# Altium project WZ_mBoard.PrjPcb (part 1 of 2)
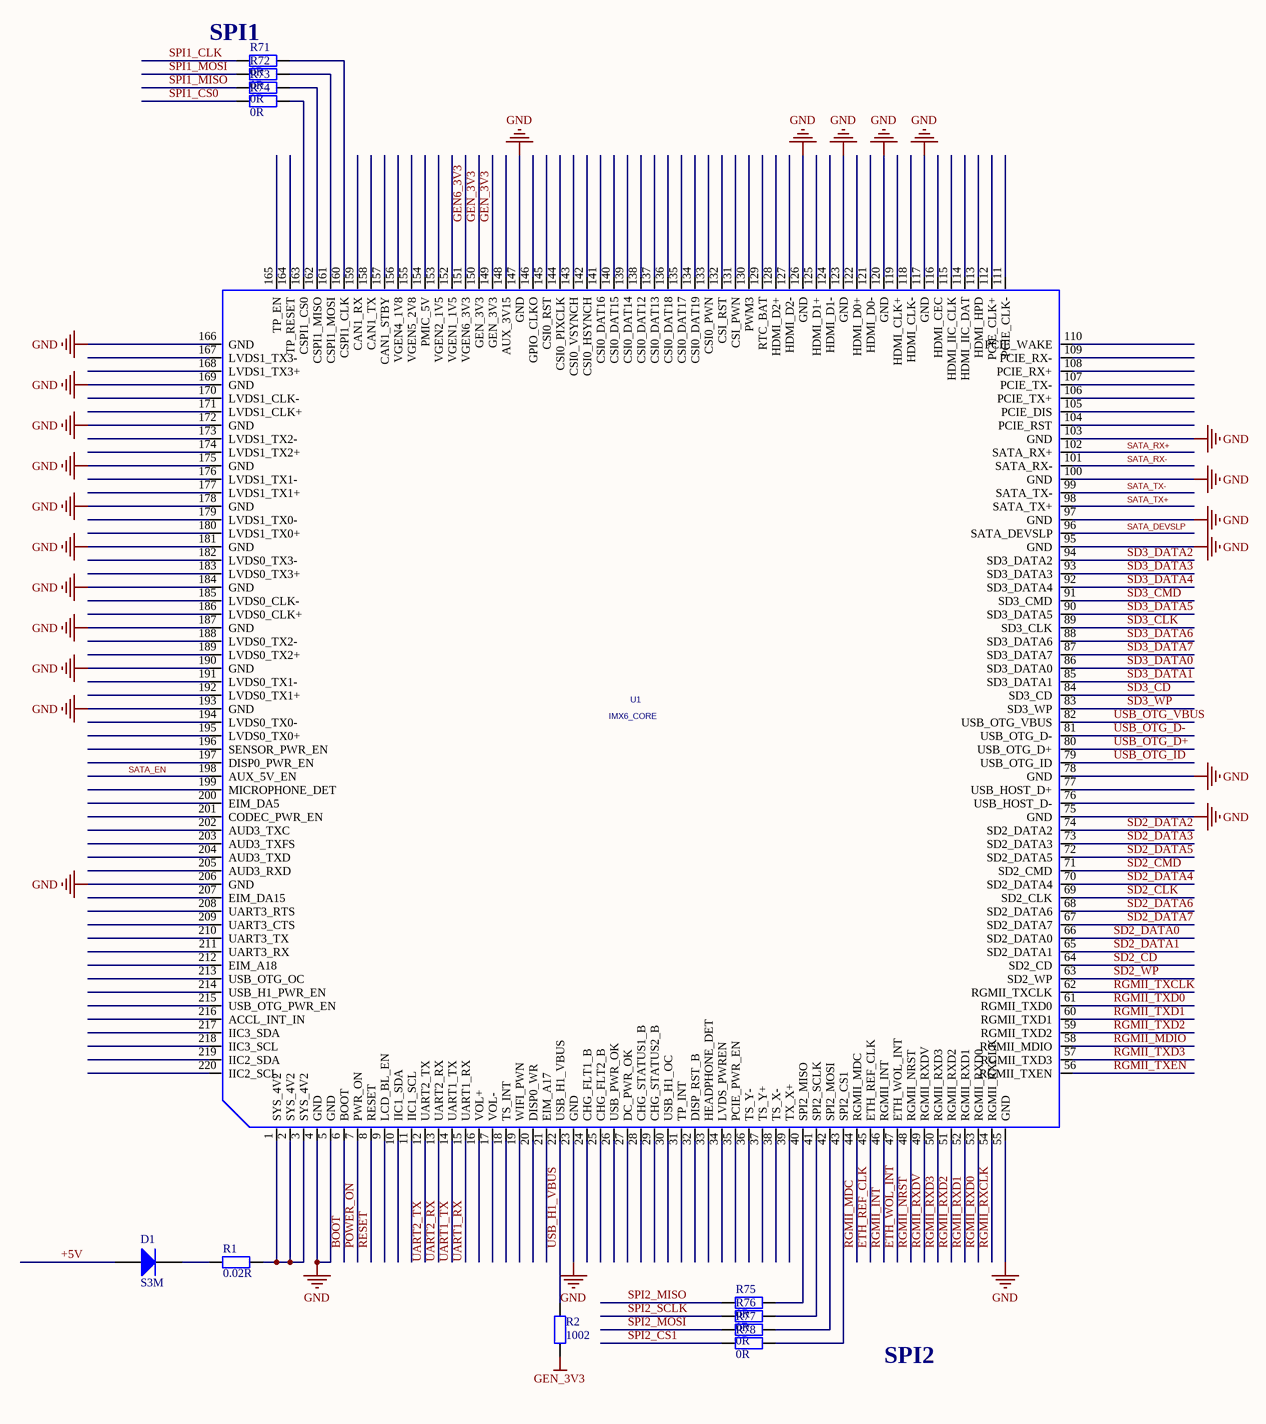
[diagram p0: IMx6Q.SchDoc]
7 sheets, 348 parts. Net scope: global (net labels, ports and power ports of the same name join across sheets).
Sheets:
  IMx6Q.SchDoc
  IMx6Q_EX.SchDoc
  EP4CE75.SchDoc
  FPGA_PWR.SchDoc
  NET.SchDoc
  485Driver_MAX3462.SchDoc
  STM32F103RBT6.SchDoc

## Sheet IMx6Q.SchDoc
size A3

### Parts
D1  S3M  [DSO-C2/X3.3]
R1  0.02R  [R1210]
R2  1002  [0603]
R71  0R  [0603]
R72  0R  [0603]
R73  0R  [0603]
R74  0R  [0603]
R75  0R  [0603]
R76  0R  [0603]
R77  0R  [0603]
R78  0R  [0603]
U1  IMX6_CORE  [IMX6_CORE]

### Nets
GEN6_3V3: U1.151(VGEN6_3V3)
GEN_3V3: R2.2 U1.149(GEN_3V3) U1.150(GEN_3V3)
GND: U1.4(GND) U1.5(GND) U1.23(GND) U1.55(GND) U1.75(GND) U1.78(GND) U1.95(GND) U1.97(GND) U1.100(GND) U1.103(GND) U1.117(GND) U1.120(GND) U1.123(GND) U1.126(GND) U1.147(GND) U1.166(GND) U1.169(GND) U1.172(GND) U1.175(GND) U1.178(GND) U1.181(GND) U1.184(GND) U1.187(GND) U1.190(GND) U1.193(GND) U1.206(GND)  [project net DGND]
USB_OTG_VBUS: U1.82(USB_OTG_VBUS)
+5V: D1.1(A)
BOOT: U1.6(BOOT)
ETH_REF_CLK: U1.45(ETH_REF_CLK)
ETH_WOL_INT: U1.47(ETH_WOL_INT)
POWER_ON: U1.7(PWR_ON)
RESET: U1.8(RESET)
RGMII_INT: U1.46(RGMII_INT)
RGMII_MDC: U1.44(RGMII_MDC)
RGMII_MDIO: U1.58(RGMII_MDIO)
RGMII_NRST: U1.48(RGMII_NRST)
RGMII_RXCLK: U1.54(RGMII_RXCLK)
RGMII_RXD0: U1.53(RGMII_RXD0)
RGMII_RXD1: U1.52(RGMII_RXD1)
RGMII_RXD2: U1.51(RGMII_RXD2)
RGMII_RXD3: U1.50(RGMII_RXD3)
RGMII_RXDV: U1.49(RGMII_RXDV)
RGMII_TXCLK: U1.62(RGMII_TXCLK)
RGMII_TXD0: U1.61(RGMII_TXD0)
RGMII_TXD1: U1.60(RGMII_TXD1)
RGMII_TXD2: U1.59(RGMII_TXD2)
RGMII_TXD3: U1.57(RGMII_TXD3)
RGMII_TXEN: U1.56(RGMII_TXEN)
SATA_DEVSLP: U1.96(SATA_DEVSLP)
SATA_EN: U1.198(AUX_5V_EN)
SATA_RX+: U1.102(SATA_RX+)
SATA_RX-: U1.101(SATA_RX-)
SATA_TX+: U1.98(SATA_TX+)
SATA_TX-: U1.99(SATA_TX-)
SD2_CD: U1.64(SD2_CD)
SD2_CLK: U1.69(SD2_CLK)
SD2_CMD: U1.71(SD2_CMD)
SD2_DATA0: U1.66(SD2_DATA0)
SD2_DATA1: U1.65(SD2_DATA1)
SD2_DATA2: U1.74(SD2_DATA2)
SD2_DATA3: U1.73(SD2_DATA3)
SD2_DATA4: U1.70(SD2_DATA4)
SD2_DATA5: U1.72(SD2_DATA5)
SD2_DATA6: U1.68(SD2_DATA6)
SD2_DATA7: U1.67(SD2_DATA7)
SD2_WP: U1.63(SD2_WP)
SD3_CD: U1.84(SD3_CD)
SD3_CLK: U1.89(SD3_CLK)
SD3_CMD: U1.91(SD3_CMD)
SD3_DATA0: U1.86(SD3_DATA0)
SD3_DATA1: U1.85(SD3_DATA1)
SD3_DATA2: U1.94(SD3_DATA2)
SD3_DATA3: U1.93(SD3_DATA3)
SD3_DATA4: U1.92(SD3_DATA4)
SD3_DATA5: U1.90(SD3_DATA5)
SD3_DATA6: U1.88(SD3_DATA6)
SD3_DATA7: U1.87(SD3_DATA7)
SD3_WP: U1.83(SD3_WP)
SPI1_CLK: R71.2
SPI1_CS0: R74.2
SPI1_MISO: R73.2
SPI1_MOSI: R72.2
SPI2_CS1: R78.2
SPI2_MISO: R75.2
SPI2_MOSI: R77.2
SPI2_SCLK: R76.2
UART1_RX: U1.15(UART1_RX)
UART1_TX: U1.14(UART1_TX)
UART2_RX: U1.13(UART2_RX)
UART2_TX: U1.12(UART2_TX)
USB_H1_VBUS: R2.1 U1.22(USB_H1_VBUS)
USB_OTG_D+: U1.80(USB_OTG_D+)
USB_OTG_D-: U1.81(USB_OTG_D-)
USB_OTG_ID: U1.79(USB_OTG_ID)
NetD1_2: D1.2(K) R1.1
NetR1_2: R1.2 U1.1(SYS_4V2) U1.2(SYS_4V2) U1.3(SYS_4V2)
NetR71_1: R71.1 U1.160(CSPI1_CLK)
NetR72_1: R72.1 U1.161(CSPI1_MOSI)
NetR73_1: R73.1 U1.162(CSPI1_MISO)
NetR74_1: R74.1 U1.163(CSPI1_CS0)
NetR75_1: R75.1 U1.40(SPI2_MISO)
NetR76_1: R76.1 U1.41(SPI2_SCLK)
NetR77_1: R77.1 U1.42(SPI2_MOSI)
NetR78_1: R78.1 U1.43(SPI2_CS1)

Not connected (* = marked no-connect by the designer): U1 9(LCD_BL_EN) 10(IIC1_SDA) 11(IIC1_SCL) 16(VOL+) 17(VOL-) 18(TS_INT) 19(WIFI_PWN) 20(DISP0_WR) 21(EIM_A17) 24(CHG_FLT1_B) 25(CHG_FLT2_B) 26(USB_PWR_OK) 27(DC_PWR_OK) 28(CHG_STATUS1_B) 29(CHG_STATUS2_B) 30(USB_H1_OC) 31(TP_INT) 32(DISP_RST_B) 33(HEADPHONE_DET) 34(LVDS_PWREN) 35(PCIE_PWR_EN) 36(TS_Y-) 37(TS_Y+) 38(TS_X-) 39(TX_X+) 76(USB_HOST_D-) 77(USB_HOST_D+) 104(PCIE_RST) 105(PCIE_DIS) 106(PCIE_TX+) 107(PCIE_TX-) 108(PCIE_RX+) 109(PCIE_RX-) 110(PCIE_WAKE) 111(PCIE_CLK-) 112(PCIE_CLK+) 113(HDMI_HPD) 114(HDMI_IIC_DAT) 115(HDMI_IIC_CLK) 116(HDMI_CEC) 118(HDMI_CLK-) 119(HDMI_CLK+) 121(HDMI_D0-) 122(HDMI_D0+) 124(HDMI_D1-) 125(HDMI_D1+) 127(HDMI_D2-) 128(HDMI_D2+) 129(RTC_BAT) 130(PWM3) 131(CSI_PWN) 132(CSI_RST) 133(CSI0_PWN) 134(CSI0_DAT19) 135(CSI0_DAT17) 136(CSI0_DAT18) 137(CSI0_DAT13) 138(CSI0_DAT12) 139(CSI0_DAT14) 140(CSI0_DAT15) 141(CSI0_DAT16) 142(CSI0_HSYNCH) 143(CSI0_VSYNCH) 144(CSI0_PIXCLK) 145(CSI0_RST) 146(GPIO_CLKO) 148(AUX_3V15) 152(VGEN1_1V5) 153(VGEN2_1V5) 154(PMIC_5V) 155(VGEN5_2V8) 156(VGEN4_1V8) 157(CAN1_STBY) 158(CAN1_TX) 159(CAN1_RX) 164(TP_RESET) 165(TP_EN) 167(LVDS1_TX3-) 168(LVDS1_TX3+) 170(LVDS1_CLK-) 171(LVDS1_CLK+) 173(LVDS1_TX2-) 174(LVDS1_TX2+) 176(LVDS1_TX1-) 177(LVDS1_TX1+) 179(LVDS1_TX0-) 180(LVDS1_TX0+) 182(LVDS0_TX3-) 183(LVDS0_TX3+) 185(LVDS0_CLK-) 186(LVDS0_CLK+) 188(LVDS0_TX2-) 189(LVDS0_TX2+) 191(LVDS0_TX1-) 192(LVDS0_TX1+) 194(LVDS0_TX0-) 195(LVDS0_TX0+) 196(SENSOR_PWR_EN) 197(DISP0_PWR_EN) 199(MICROPHONE_DET) 200(EIM_DA5) 201(CODEC_PWR_EN) 202(AUD3_TXC) 203(AUD3_TXFS) 204(AUD3_TXD) 205(AUD3_RXD) 207(EIM_DA15) 208(UART3_RTS) 209(UART3_CTS) 210(UART3_TX) 211(UART3_RX) 212(EIM_A18) 213(USB_OTG_OC) 214(USB_H1_PWR_EN) 215(USB_OTG_PWR_EN) 216(ACCL_INT_IN) 217(IIC3_SDA) 218(IIC3_SCL) 219(IIC2_SDA) 220(IIC2_SCL)

### Notes on the sheet
- (near R71) SPI1
- SPI2

### Library data of the parts
D1 = Diode: Default Diode; Published: 8-Jun-2000; LatestRevisionDate: 17-Jul-2002; LatestRevisionNote: Re-released for DXP Platform.; PackageVersion: Sep-1996; PackageReference: SMC; Publisher: Altium Limited; Code_JEDEC: DO-214-AB
R1 R2 = Res2: Resistor; Value: 1K; Published: 8-Jun-2000; LatestRevisionDate: 17-Jul-2002; LatestRevisionNote: Re-released for DXP Platform.; PackageReference: AXIAL-0.4; Publisher: Altium Limited
R71-R78 = 电阻
U1 = IMX6_CORE: PCB DECAL: IMX6_CORE

## Sheet IMx6Q_EX.SchDoc
size A3
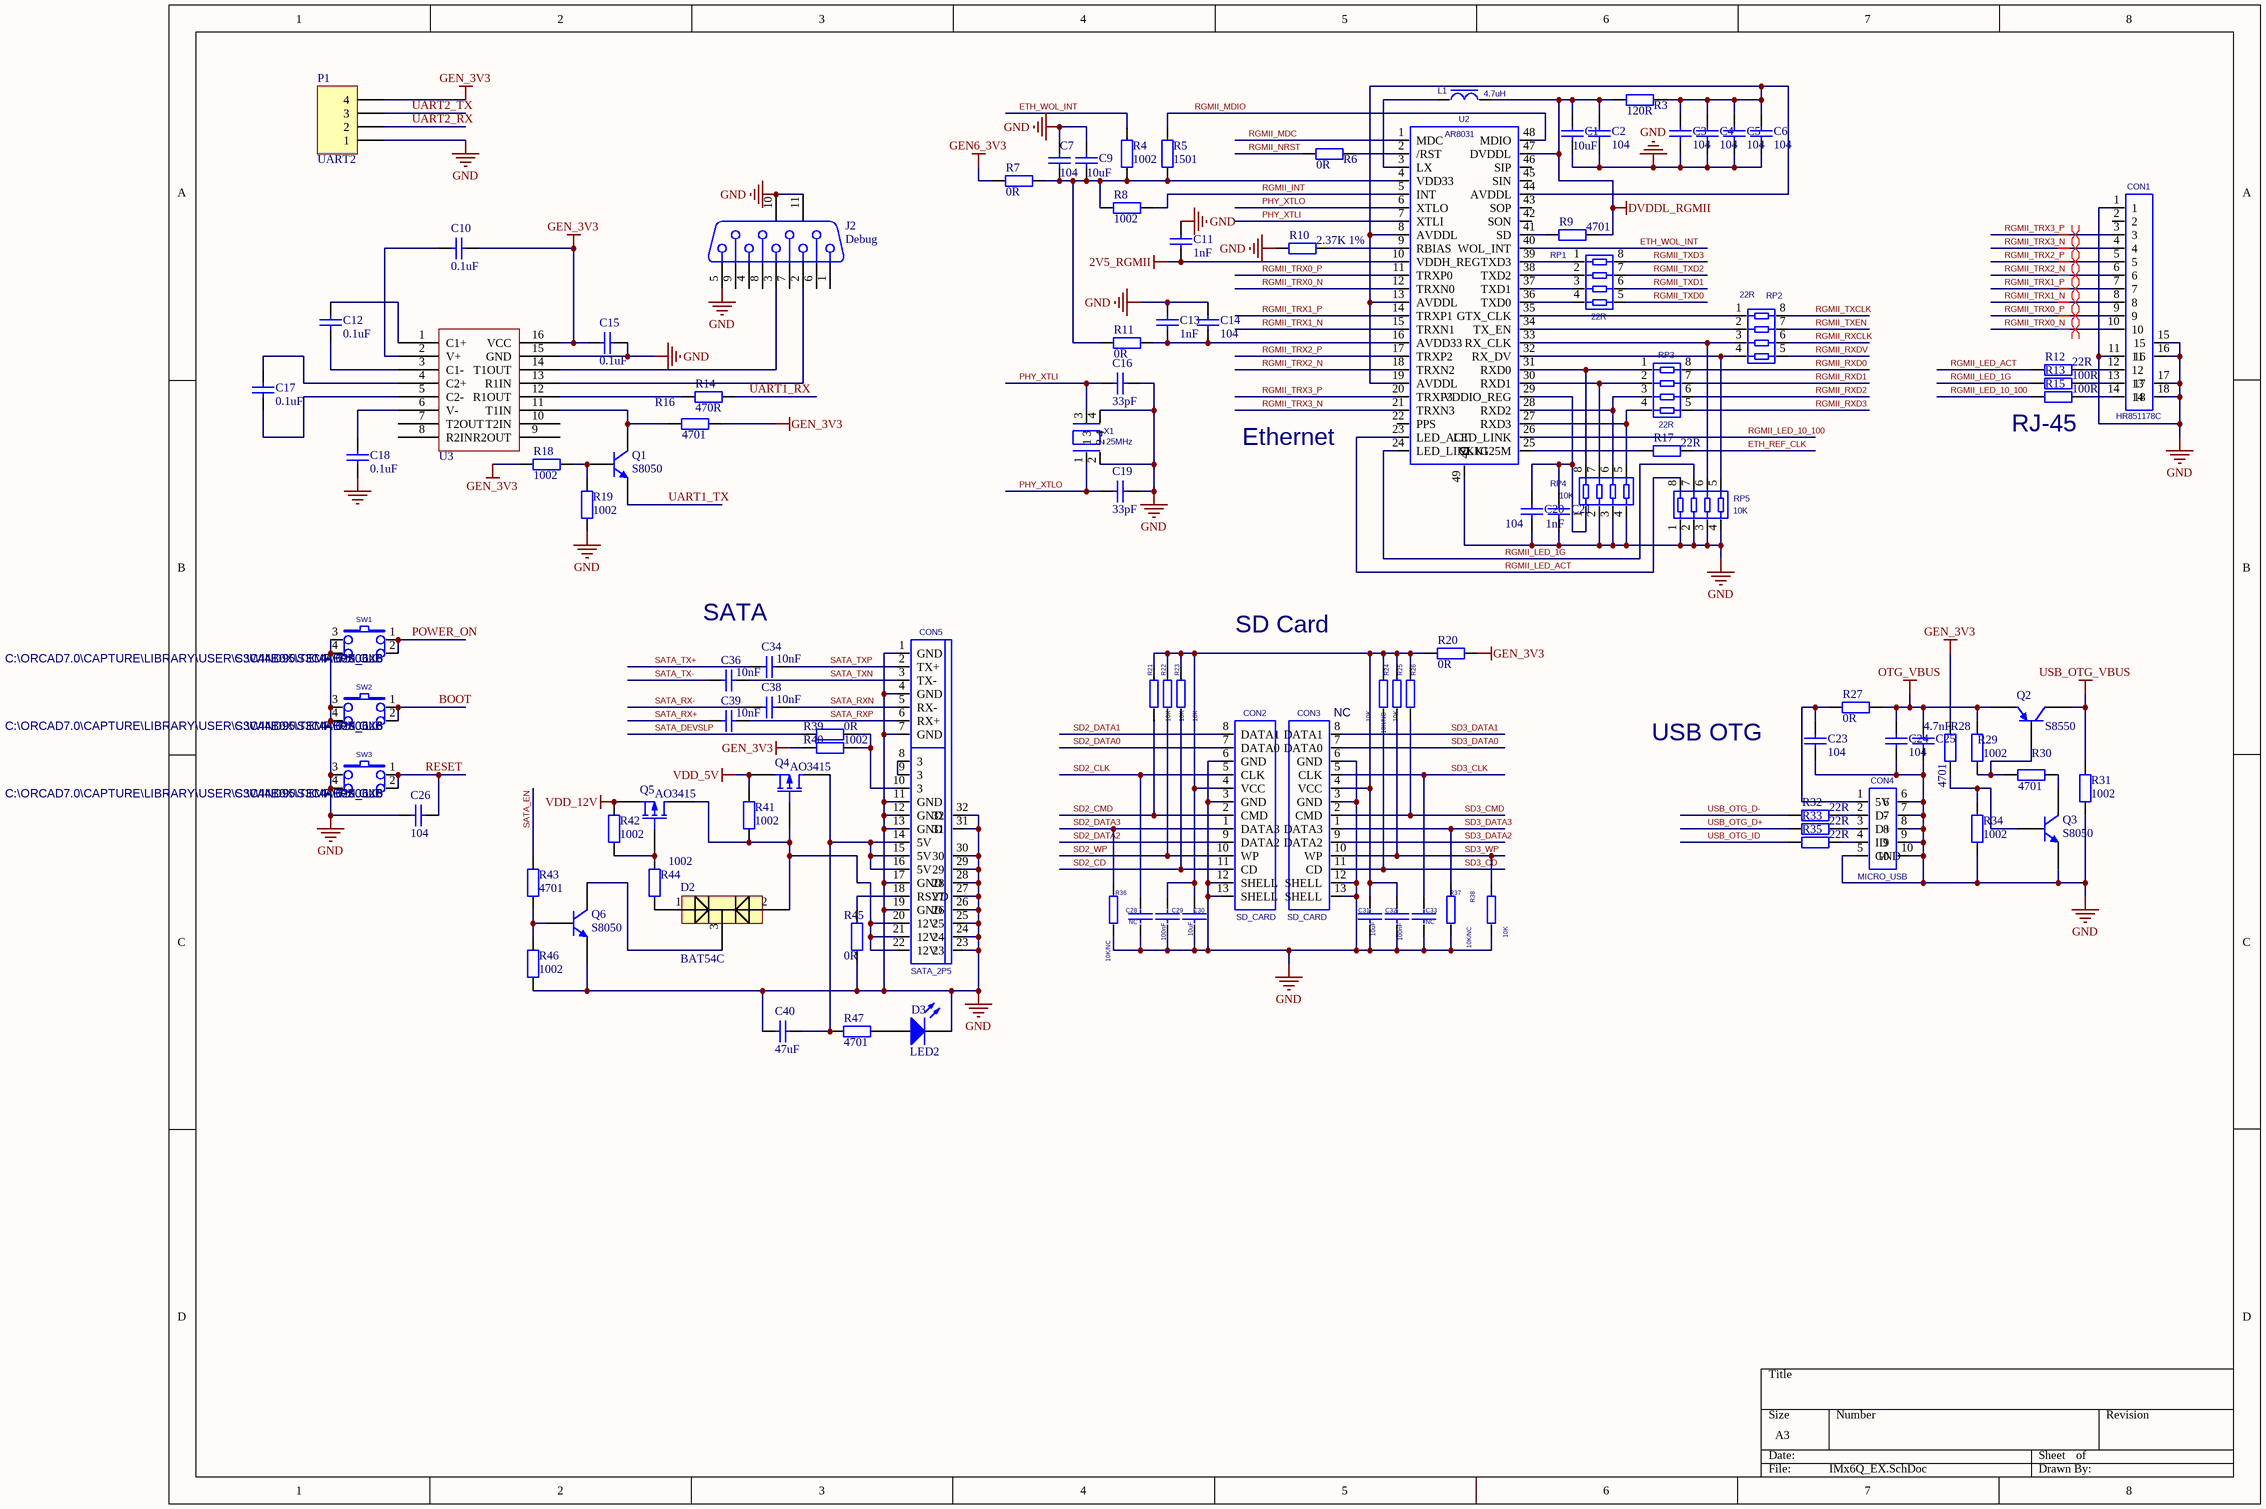
[diagram p1: IMx6Q_EX.SchDoc]

### Parts
C1  10uF  [0805C]
C2  104  [0805C]
C3  104  [0805C]
C4  104  [0805C]
C5  104  [0805C]
C6  104  [0805C]
C7  104  [0805C]
C9  10uF  [0805C]
C10  0.1uF  [0805C]
C11  1nF  [0805C]
C12  0.1uF  [0805C]
C13  1nF  [0805C]
C14  104  [0805C]
C15  0.1uF  [0805C]
C16  33pF  [0805C]
C17  0.1uF  [0805C]
C18  0.1uF  [0805C]
C19  33pF  [0805C]
C20  104  [0805C]
C21  1nF  [0805C]
C23  104  [0805C]
C24  104  [0805C]
C25  4.7nF  [0805C]
C26  104  [0805C]
C28  value NC  [0805C]  (hidden comment: C_0603)
C29  value 100nF  [0805C]  (hidden comment: C_0603)
C30  value 10uF  [0805C]  (hidden comment: C_0603)
C31  value 10uF  [0805C]  (hidden comment: C_0603)
C32  value 100nF  [0805C]  (hidden comment: C_0603)
C33  value NC  [0805C]  (hidden comment: C_0603)
C34  10nF  [0805C]
C36  10nF  [0805C]
C38  10nF  [0805C]
C39  10nF  [0805C]
C40  47uF  [0805C]
CON1  HR851178C  [HR851178C]
CON2  SD_CARD  [SD_CARD]
CON3  SD_CARD  [SD_CARD]
CON4  MICRO_USB  [MICRO_USB]
CON5  SATA_2P5  [SATA_MICRO_2P5]
D2  BAT54C  [SOT-23-3]
D3  LED2  [0805_LED]
J2  Debug  [DSUB1.385-2H9]
L1  value 4.7uH  [L_3-3]  (hidden comment: L_3-3)
P1  UART2  [HDR1X4]
Q1  S8050  [SOT23]
Q2  S8550  [SOT23-S8550]
Q3  S8050  [SOT23]
Q4  AO3415  [SOT23-AO3415]
Q5  AO3415  [SOT23-AO3415]
Q6  S8050  [SOT23-AO3415]
R3  120R  [0805R]
R4  1002  [0805R]
R5  1501  [0805R]
R6  0R  [0805R]
R7  0R  [0805R]
R8  1002  [0805R]
R9  4701  [0805R]
R10  2.37K 1%  [0805R]
R11  0R  [0805R]
R12  22R  [0805R]
R13  100R  [0805R]
R14  470R  [0805R]
R15  100R  [0805R]
R16  4701  [0805R]
R17  22R  [0805R]
R18  1002  [0805R]
R19  1002  [0805R]
R20  0R  [0805R]
R21  value 10K  [0805R]  (hidden comment: R_0603)
R22  value 10K  [0805R]  (hidden comment: R_0603)
R23  value 10K  [0805R]  (hidden comment: R_0603)
R24  value 10K  [0805R]  (hidden comment: R_0603)
R25  value 10K/NC  [0805R]  (hidden comment: R_0603)
R26  value 10K  [0805R]  (hidden comment: R_0603)
R27  0R  [0805R]
R28  4701  [0805R]
R29  1002  [0805R]
R30  4701  [0805R]
R31  1002  [0805R]
R32  22R  [0805R]
R33  22R  [0805R]
R34  1002  [0805R]
R35  22R  [0805R]
R36  value 10K/NC  [0805R]  (hidden comment: R_0603)
R37  value 10K/NC  [0805R]  (hidden comment: R_0603)
R38  value 10K  [0805R]  (hidden comment: R_0603)
R39  0R  [0805R]
R40  1002  [0805R]
R41  1002  [0805R]
R42  1002  [0805R]
R43  4701  [0805R]
R44  1002  [0805R]
R45  0R  [0805R]
R46  1002  [0805R]
R47  4701  [0805R]
RP1  value 22R  [RP4_0603]  (hidden comment: RP4_0603)
RP2  value 22R  [RP4_0603]  (hidden comment: RP4_0603)
RP3  value 22R  [RP4_0603]  (hidden comment: RP4_0603)
RP4  value 10K  [RP4_0603]  (hidden comment: RP4_0603)
RP5  value 10K  [RP4_0603]  (hidden comment: RP4_0603)
SW1  ALPS_6X6  Source Path: C:\ORCAD7.0\CAPTURE\LIBRARY\USER\S3C44B0X\S3C44B0X.OLB  SDTSourceLibName: C:\WIND95\TEMP\6200.LIB  [ALPS_6*6]
SW2  ALPS_6X6  Source Path: C:\ORCAD7.0\CAPTURE\LIBRARY\USER\S3C44B0X\S3C44B0X.OLB  SDTSourceLibName: C:\WIND95\TEMP\6200.LIB  [ALPS_6*6]
SW3  ALPS_6X6  Source Path: C:\ORCAD7.0\CAPTURE\LIBRARY\USER\S3C44B0X\S3C44B0X.OLB  SDTSourceLibName: C:\WIND95\TEMP\6200.LIB  [ALPS_6*6]
U2  AR8031  [QFN-48]
U3  MAX232  [SOP16]  (value not drawn)
X1  value 25MHz  [OSC_3225_4P]  (hidden comment: OSC_3225_4P)

### Nets
2V5_RGMII: C11.2 U2.10(VDDH_REG)
DVDDL_RGMII: C1.1 C2.1 L1.2 R3.1 R9.1 U2.47(DVDDL)
GEN6_3V3: R7.1
GEN_3V3: C10.1 C15.2 P1.4 R16.1 R18.2 R20.2 R28.2 R40.2 U3.16(VCC)
GND: C1.2 C2.2 C3.2 C4.2 C5.2 C6.2 C7.2 C9.2 C11.1 C13.1 C14.1 C15.1 C16.2 C18.1 C19.2 C20.2 C21.2 C23.2 C24.2 C25.2 C26.1 C28.1 C29.1 C30.1 C31.1 C32.1 C33.1 C40.2 CON1.1 CON1.11 CON1.15 CON1.16 CON1.17 CON1.18 CON2.3(GND) CON2.6(GND) CON2.12(SHELL) CON2.13(SHELL) CON3.3(GND) CON3.6(GND) CON3.12(SHELL) CON3.13(SHELL) CON4.5(GND) CON4.6 CON4.7 CON4.8 CON4.9 CON4.10 CON5.1(GND) CON5.4(GND) CON5.7(GND) CON5.11(GND) CON5.12(GND) CON5.13(GND) CON5.17(GND) CON5.19(GND) CON5.23 CON5.24 CON5.25 CON5.26 CON5.27 CON5.28 CON5.29 CON5.30 CON5.31 CON5.32 D3.2(K) J2.5 J2.10(MH1) J2.11(MH2) P1.1 Q3.1(E) Q6.3(E) R10.1 R19.2 R31.1 R34.1 R36.1 R37.1 R38.1 R45.2 R46.2 RP4.2 RP4.3 RP4.4 RP5.1 RP5.2 RP5.3 RP5.4 SW1.3 SW1.4 SW2.3 SW2.4 SW3.3 SW3.4 U2.49 U3.15(GND) X1.2 X1.4  [project net DGND]
OTG_VBUS: C24.1 C25.1 Q2.3(E) R27.2 R29.2
USB_OTG_VBUS: Q2.1(C) R31.2
VDD_5V: Q4.3(S) R41.1
VDD_12V: Q5.3(S) R42.1
BOOT: SW2.1 SW2.2
ETH_REF_CLK: R17.1
ETH_WOL_INT: R4.2 U2.40(WOL_INT)
PHY_XTLI: C16.1 U2.7(XTLI) X1.3
PHY_XTLO: C19.1 U2.6(XTLO) X1.1
POWER_ON: SW1.1 SW1.2
RESET: C26.2 SW3.1 SW3.2
RGMII_INT: R8.1 U2.5(INT)
RGMII_LED_1G: R13.2 RP5.7 U2.24(LED_LINK1G)
RGMII_LED_10_100: R15.2 U2.26(LED_LINK)
RGMII_LED_ACT: R12.2 RP5.8 U2.23(LED_ACT)
RGMII_MDC: U2.1(MDC)
RGMII_MDIO: R5.2 U2.48(MDIO)
RGMII_NRST: R6.1
RGMII_RXCLK: RP2.6
RGMII_RXD0: RP3.8
RGMII_RXD1: RP3.7
RGMII_RXD2: RP3.6
RGMII_RXD3: RP3.5
RGMII_RXDV: RP2.5
RGMII_TRX0_N: CON1.10 U2.12(TRXN0)
RGMII_TRX0_P: CON1.9 U2.11(TRXP0)
RGMII_TRX1_N: CON1.8 U2.15(TRXN1)
RGMII_TRX1_P: CON1.7 U2.14(TRXP1)
RGMII_TRX2_N: CON1.6 U2.18(TRXN2)
RGMII_TRX2_P: CON1.5 U2.17(TRXP2)
RGMII_TRX3_N: CON1.4 U2.21(TRXN3)
RGMII_TRX3_P: CON1.3 U2.20(TRXP3)
RGMII_TXCLK: RP2.8
RGMII_TXD0: RP1.5
RGMII_TXD1: RP1.6
RGMII_TXD2: RP1.7
RGMII_TXD3: RP1.8
RGMII_TXEN: RP2.7
SATA_DEVSLP: R39.2
SATA_EN: R43.1
SATA_RX+: C39.1
SATA_RX-: C38.1
SATA_RXN: C38.2 CON5.5(RX-)
SATA_RXP: C39.2 CON5.6(RX+)
SATA_TX+: C34.1
SATA_TX-: C36.1
SATA_TXN: C36.2 CON5.3(TX-)
SATA_TXP: C34.2 CON5.2(TX+)
SD2_CD: CON2.11(CD) R23.1
SD2_CLK: C28.2 CON2.5(CLK)
SD2_CMD: CON2.2(CMD) R21.1
SD2_DATA0: CON2.7(DATA0)
SD2_DATA1: CON2.8(DATA1)
SD2_DATA2: CON2.9(DATA2)
SD2_DATA3: CON2.1(DATA3) R36.2
SD2_WP: CON2.10(WP) R22.1
SD3_CD: CON3.11(CD) R24.1
SD3_CLK: C33.2 CON3.5(CLK)
SD3_CMD: CON3.2(CMD) R26.1
SD3_DATA0: CON3.7(DATA0)
SD3_DATA1: CON3.8(DATA1)
SD3_DATA2: CON3.9(DATA2)
SD3_DATA3: CON3.1(DATA3) R37.2
SD3_WP: CON3.10(WP) R25.1 R38.2
UART1_RX: R14.2
UART1_TX: Q1.1(E)
UART2_RX: P1.2
UART2_TX: P1.3
USB_OTG_D+: R33.2
USB_OTG_D-: R32.2
USB_OTG_ID: R35.2
NetC3_1: C3.1 C4.1 C5.1 C6.1 R3.2 U2.8(AVDDL) U2.13(AVDDL) U2.19(AVDDL) U2.44(AVDDL)
NetC7_1: C7.1 C9.1 R4.1 R5.1 R7.2 R8.2 R11.1 U2.4(VDD33)
NetC10_2: C10.2 U3.2(V+)
NetC12_1: C12.1 U3.3(C1-)
NetC12_2: C12.2 U3.1(C1+)
NetC13_2: C13.2 C14.2 R11.2 U2.16(AVDD33)
NetC17_1: C17.1 U3.5(C2-)
NetC17_2: C17.2 U3.4(C2+)
NetC18_2: C18.2 U3.6(V-)
NetC20_1: C20.1 C21.1 RP4.1 U2.29(VDDIO_REG)
NetC23_1: C23.1 CON4.1(5V) R27.1
NetC29_2: C29.2 C30.2 C31.2 C32.2 CON2.4(VCC) CON3.4(VCC) R20.1 R21.2 R22.2 R23.2 R24.2 R25.2 R26.2
NetC40_1: C40.1 CON5.14(5V) CON5.15(5V) CON5.16(5V) Q4.1(D) R47.1
NetCON1_12: CON1.12 R12.1
NetCON1_13: CON1.13 R13.1
NetCON1_14: CON1.14 R15.1
NetCON4_2: CON4.2(D-) R32.1
NetCON4_3: CON4.3(D+) R33.1
NetCON4_4: CON4.4(ID) R35.1
NetCON5_8: CON5.8(3) CON5.9(3)
NetCON5_10: CON5.10(3) R39.1 R40.1
NetCON5_18: CON5.18(RSVD) R45.1
NetCON5_20: CON5.20(12V) CON5.21(12V) CON5.22(12V) D2.2(A) Q4.2(G) Q5.1(D) R41.2
NetD2_1: D2.1(A) R44.1
NetD2_3: D2.3(C) Q6.1(C)
NetD3_1: D3.1(A) R47.2
NetJ2_2: J2.2 U3.13(R1IN)
NetJ2_3: J2.3 U3.14(T1OUT)
NetL1_1: L1.1 U2.3(LX)
NetQ1_2: Q1.2(B) R18.1 R19.1
NetQ1_3: Q1.3(C) R16.2 U3.11(T1IN)
NetQ2_2: Q2.2(B) R29.1 R30.2
NetQ3_2: Q3.2(B) R28.1 R34.2
NetQ3_3: Q3.3(C) R30.1
NetQ5_2: Q5.2(G) R42.2 R44.2
NetQ6_2: Q6.2(B) R43.2 R46.1
NetR6_2: R6.2 U2.2(/RST)
NetR9_2: R9.2 U2.41(SD)
NetR10_2: R10.2 U2.9(RBIAS)
NetR14_1: R14.1 U3.12(R1OUT)
NetR17_2: R17.2 U2.25(CLK125M)
NetRP1_1: RP1.1 U2.39(TXD3)
NetRP1_2: RP1.2 U2.38(TXD2)
NetRP1_3: RP1.3 U2.37(TXD1)
NetRP1_4: RP1.4 U2.36(TXD0)
NetRP2_1: RP2.1 U2.35(GTX_CLK)
NetRP2_2: RP2.2 U2.34(TX_EN)
NetRP2_3: RP2.3 RP5.6 U2.33(RX_CLK)
NetRP2_4: RP2.4 RP5.5 U2.32(RX_DV)
NetRP3_1: RP3.1 RP4.8 U2.31(RXD0)
NetRP3_2: RP3.2 RP4.7 U2.30(RXD1)
NetRP3_3: RP3.3 RP4.6 U2.28(RXD2)
NetRP3_4: RP3.4 RP4.5 U2.27(RXD3)

Not connected (* = marked no-connect by the designer): CON1 2; J2 1 4 6 7 8 9; U2 22(PPS) 42(SON) 43(SOP) 45(SIN) 46(SIP); U3 7(T2OUT) 8(R2IN) 9(R2OUT) 10(T2IN)

### Layout directives
differential pair: RGMII_TRX0_N, RGMII_TRX0_P, RGMII_TRX1_N, RGMII_TRX1_P, RGMII_TRX2_N, RGMII_TRX2_P, RGMII_TRX3_N, RGMII_TRX3_P

### Notes on the sheet
- Ethernet
- (near R15) RJ-45
- SATA
- SD Card
- (near CON3) NC
- USB OTG

### Library data of the parts
C1-C7 C9 C11 C13 C14 C16 C19-C21 C23-C26 C34 C36 C38-C40 = Cap: Capacitor; Value: 100pF; Published: 8-Jun-2000; LatestRevisionDate: 17-Jul-2002; LatestRevisionNote: Re-released for DXP Platform.; PackageReference: RAD-0.3; Publisher: Altium Limited
C10 C12 C15 C17 C18 = 电容
D3 = LED2: Typical RED, GREEN, YELLOW, AMBER GaAs LED; Published: 8-Jun-2000; LatestRevisionDate: 17-Jul-2002; LatestRevisionNote: Re-released for DXP Platform.; PackageVersion: Feb-2002; PackageReference: 3.2X1.6X1.1; Publisher: Altium Limited
J2 = D Connector 9: Receptacle Assembly, 9 Position, Right Angle; PackageDocument: O; Positions: 9; Published: 15-Jun-2001; LatestRevisionDate: 17-Jul-2002; LatestRevisionNote: Re-released for DXP Platform.; DatasheetDocument: 1-Sep-1999; PackageReference: 788750; Publisher: Altium Limited; Orientation: Right Angle; Gender: Receptacle
P1 = Header 4: Header, 4-Pin; LatestRevisionDate: 17-Jul-2002; LatestRevisionNote: Re-released for DXP Platform.; Publisher: Altium Limited
Q1 Q3 = 2N3904: NPN General Purpose Amplifier; Published: 8-Jun-2000; LatestRevisionDate: 15-Jan-2003; LatestRevisionNote: PCB Footprint 'BCY-W3/D4.7' replaced; DatasheetVersion: 1997; PackageVersion: Sep-1998; PackageReference: TO-92A; Publisher: Altium Limited; Code_JEDEC: TO-92A; ComponentLink1Description: Manufacturer Link; ComponentLink1URL: http://www.fairchildsemi.com/; ComponentLink2Description: Datasheet; ComponentLink2URL: http://www.fairchildsemi.com/ds/2N%2F2N3904.pdf
Q2 = PNP: PNP Bipolar Transistor; Published: 8-Jun-2000; LatestRevisionDate: 29-May-2009; LatestRevisionNote: IPC-7351 Footprint Added.; PackageVersion: Aug-1999; PackageReference: SOT-23B; Publisher: Altium Limited; PackageDescription: 3-Pin SOT-23 Package 0.95 mm Pitch, 2.4 mm Lead Span
Q4 Q5 = MOSFET-P: P-Channel MOSFET; Published: 8-Jun-2000; LatestRevisionDate: 17-Jul-2002; LatestRevisionNote: Re-released for DXP Platform.; PackageVersion: 1995/1996; PackageReference: E3; Publisher: Altium Limited
Q6 = NPN: NPN Bipolar Transistor; Published: 8-Jun-2000; LatestRevisionDate: 17-Jul-2002; LatestRevisionNote: Re-released for DXP Platform.; PackageReference: TO-226; Publisher: Altium Limited; Code_JEDEC: TO-226-AA
R3-R8 R10 R11 R14 R20 R27-R31 R34 = 电阻
R9 R12 R13 R15-R19 R32 R33 R35 R39-R47 = Res2: Resistor; Value: 1K; Published: 8-Jun-2000; LatestRevisionDate: 17-Jul-2002; LatestRevisionNote: Re-released for DXP Platform.; PackageReference: AXIAL-0.4; Publisher: Altium Limited
SW1-SW3 = ALPS_6X6: PCB Footprint: TM118D-A; Value: SW_PUSH2; PCB DECAL: ALPS_6X6
CON1 = HR851178C: PCB DECAL: HR851178C
CON2 CON3 = SD_CARD: PCB DECAL: SD_CARD
CON4 = MICRO_USB: PCB DECAL: MICRO_USB
CON5 = SATA_2P5: PCB DECAL: SATA_2P5
L1 = L_3-3: PCB DECAL: L_3-3
RP1-RP5 = RP4_0603: PCB DECAL: RP4_0603
U2 = AR8031: PCB DECAL: QFN-48
X1 = OSC_3225_4P: PCB DECAL: OSC_3225_4P

## Sheet EP4CE75.SchDoc
size A1
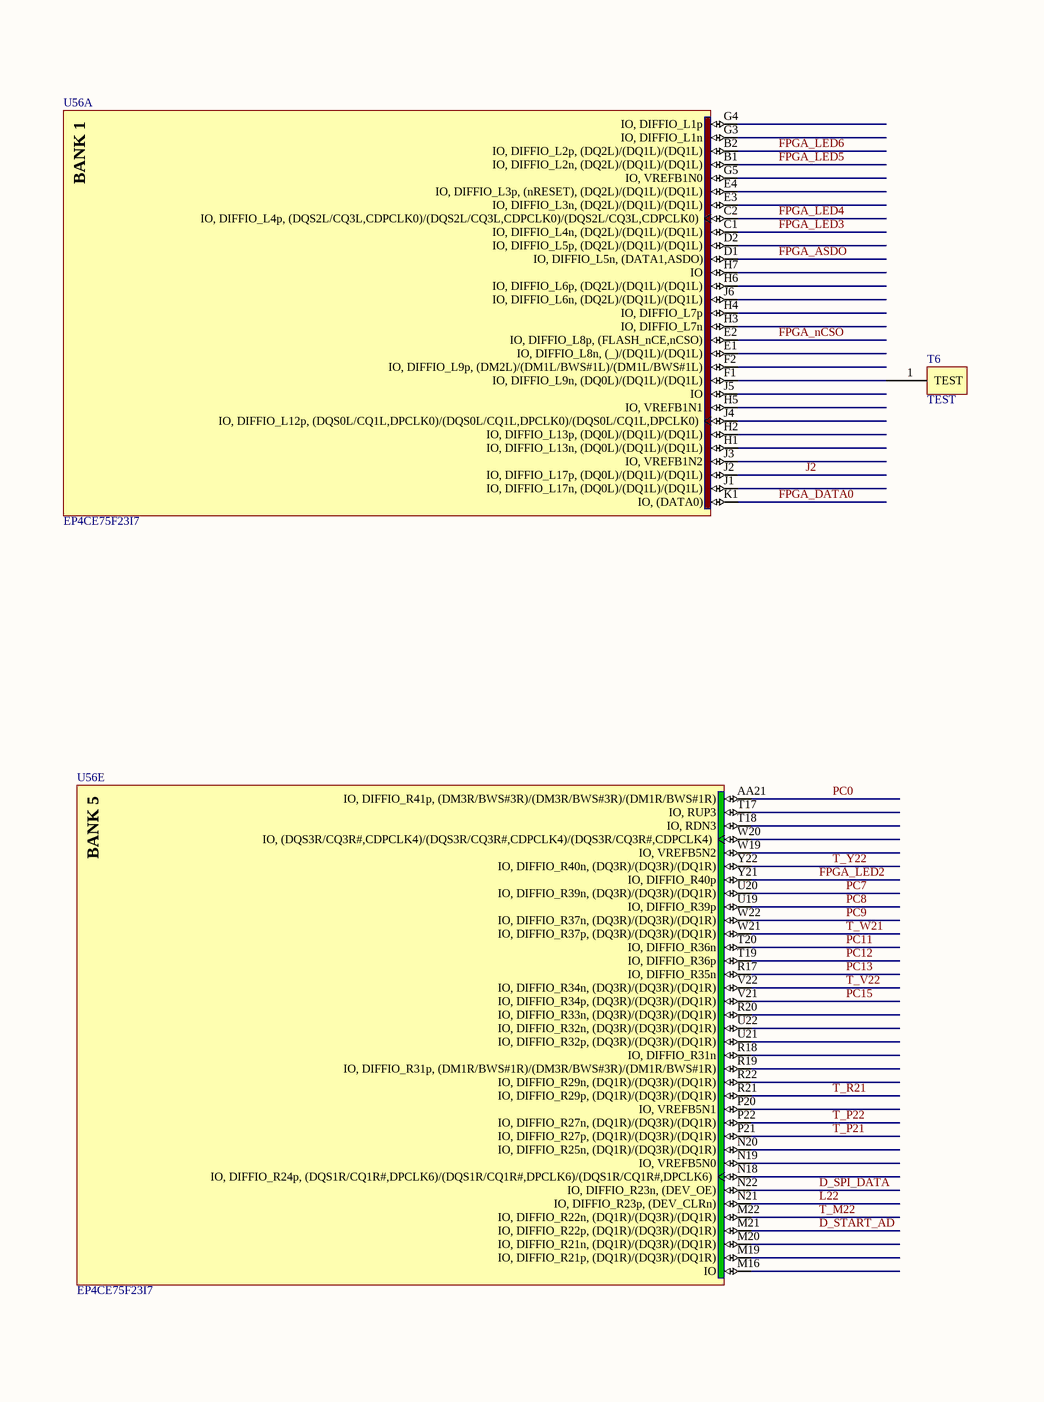
[diagram p2: EP4CE75.SchDoc, top left]
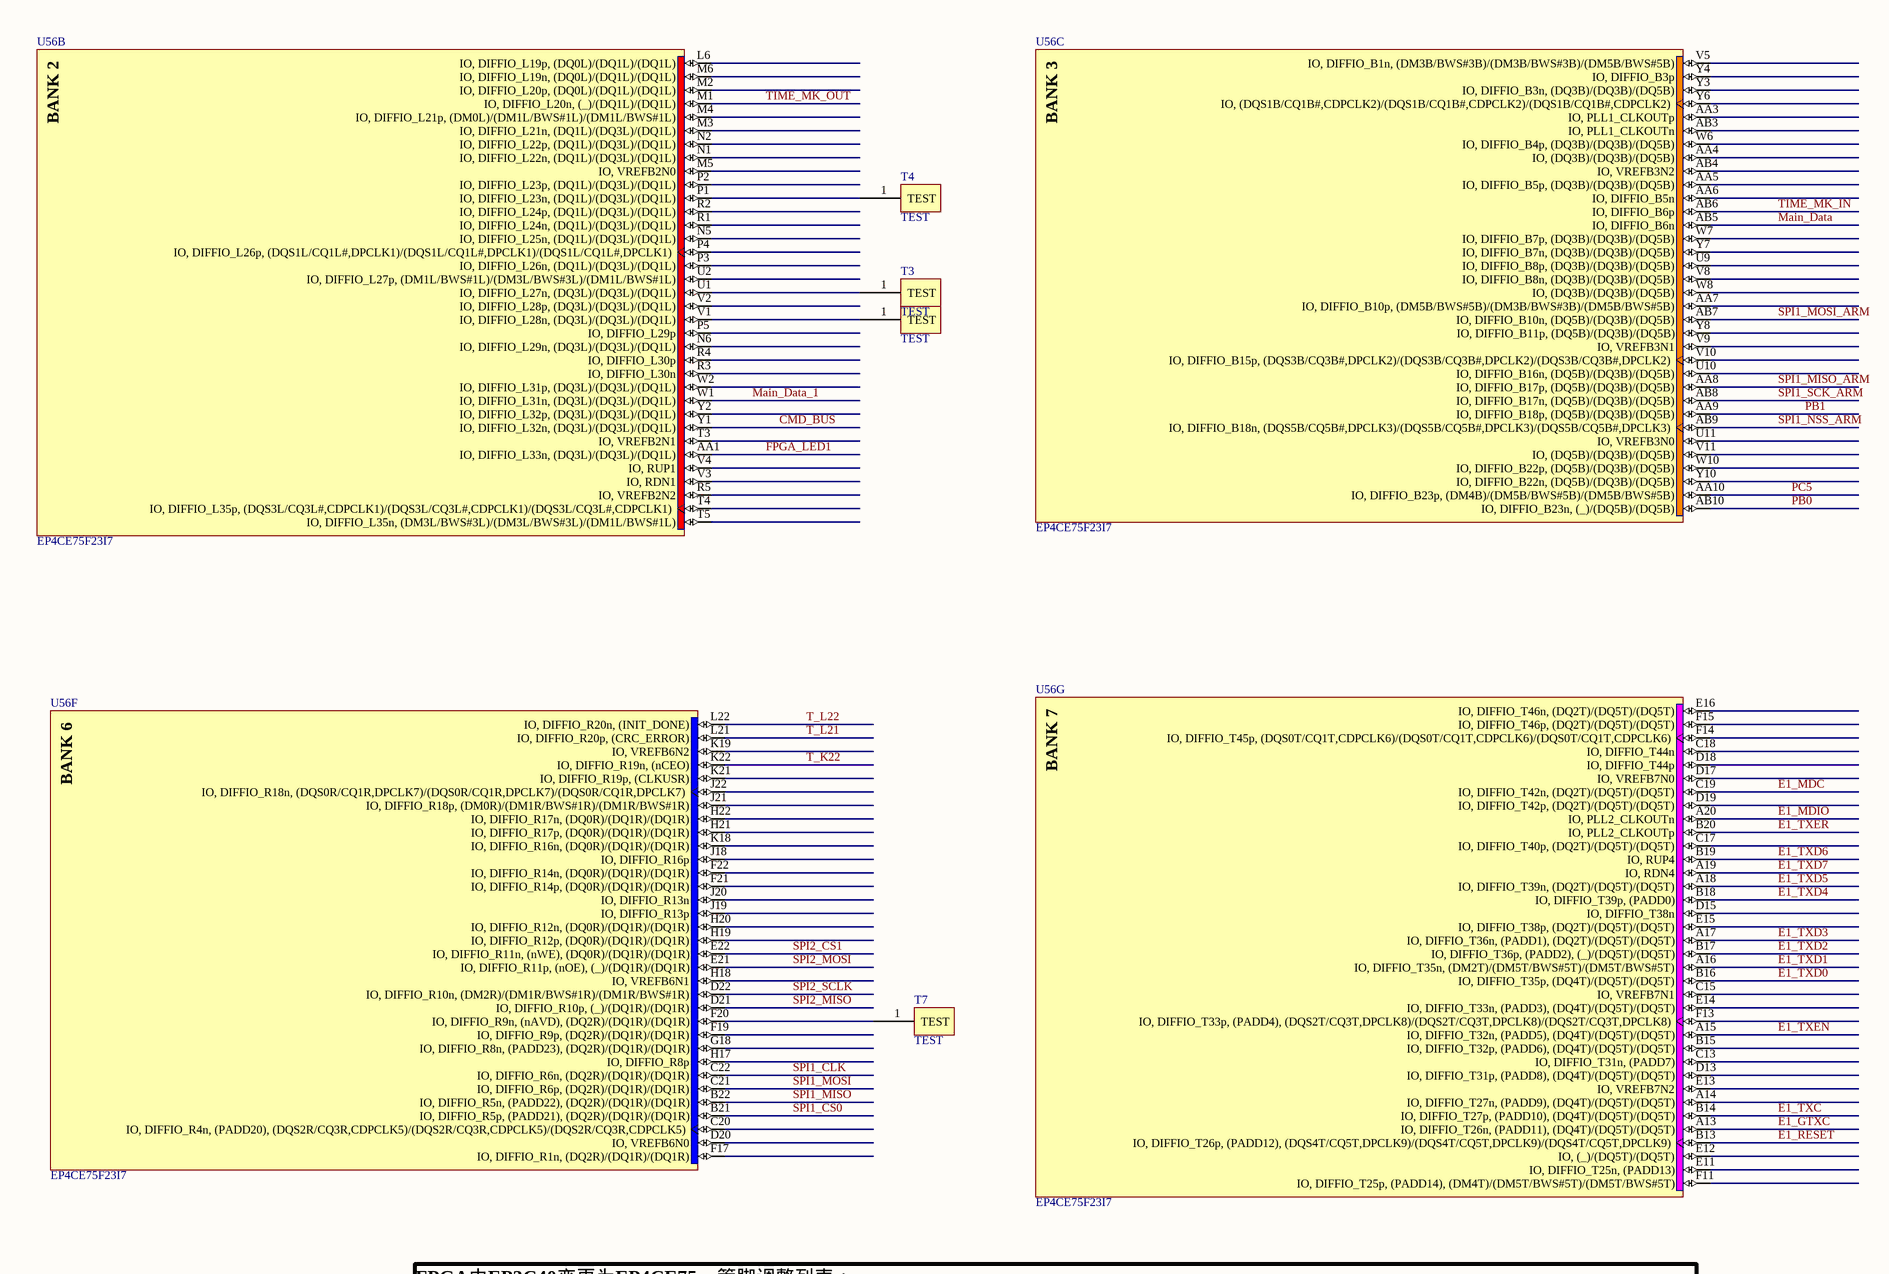
[diagram p3: EP4CE75.SchDoc, top middle]
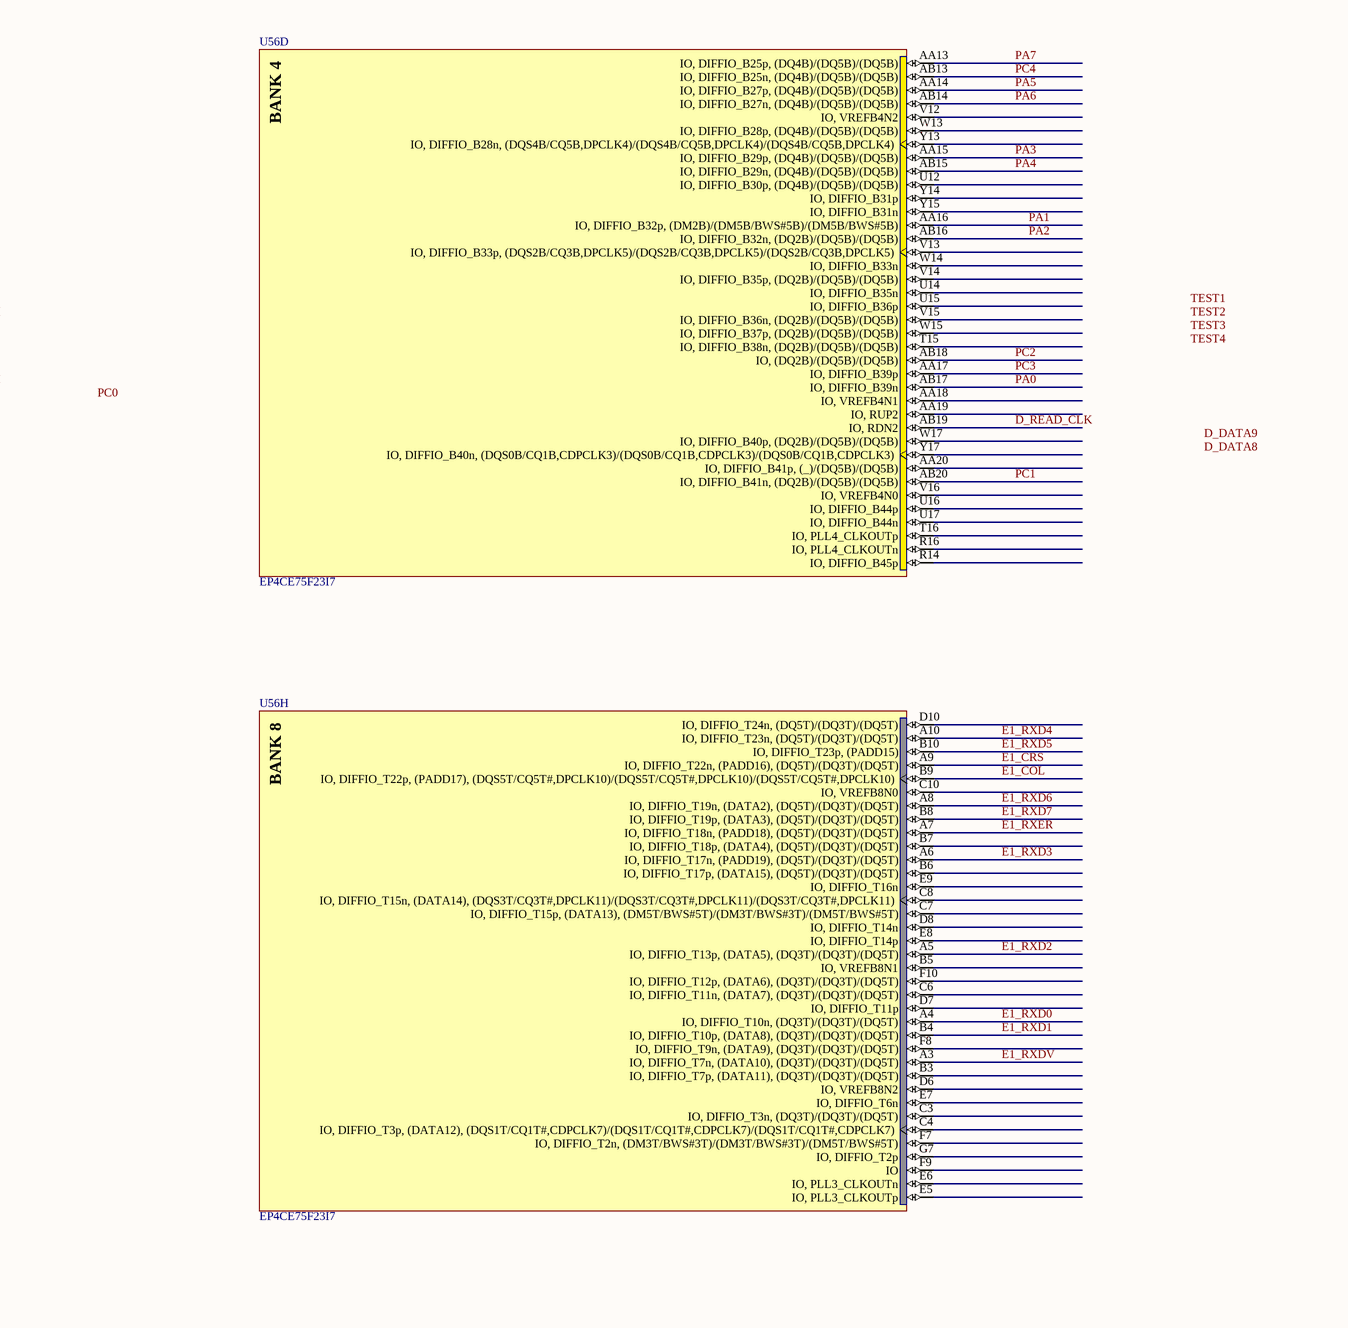
[diagram p4: EP4CE75.SchDoc, top right]
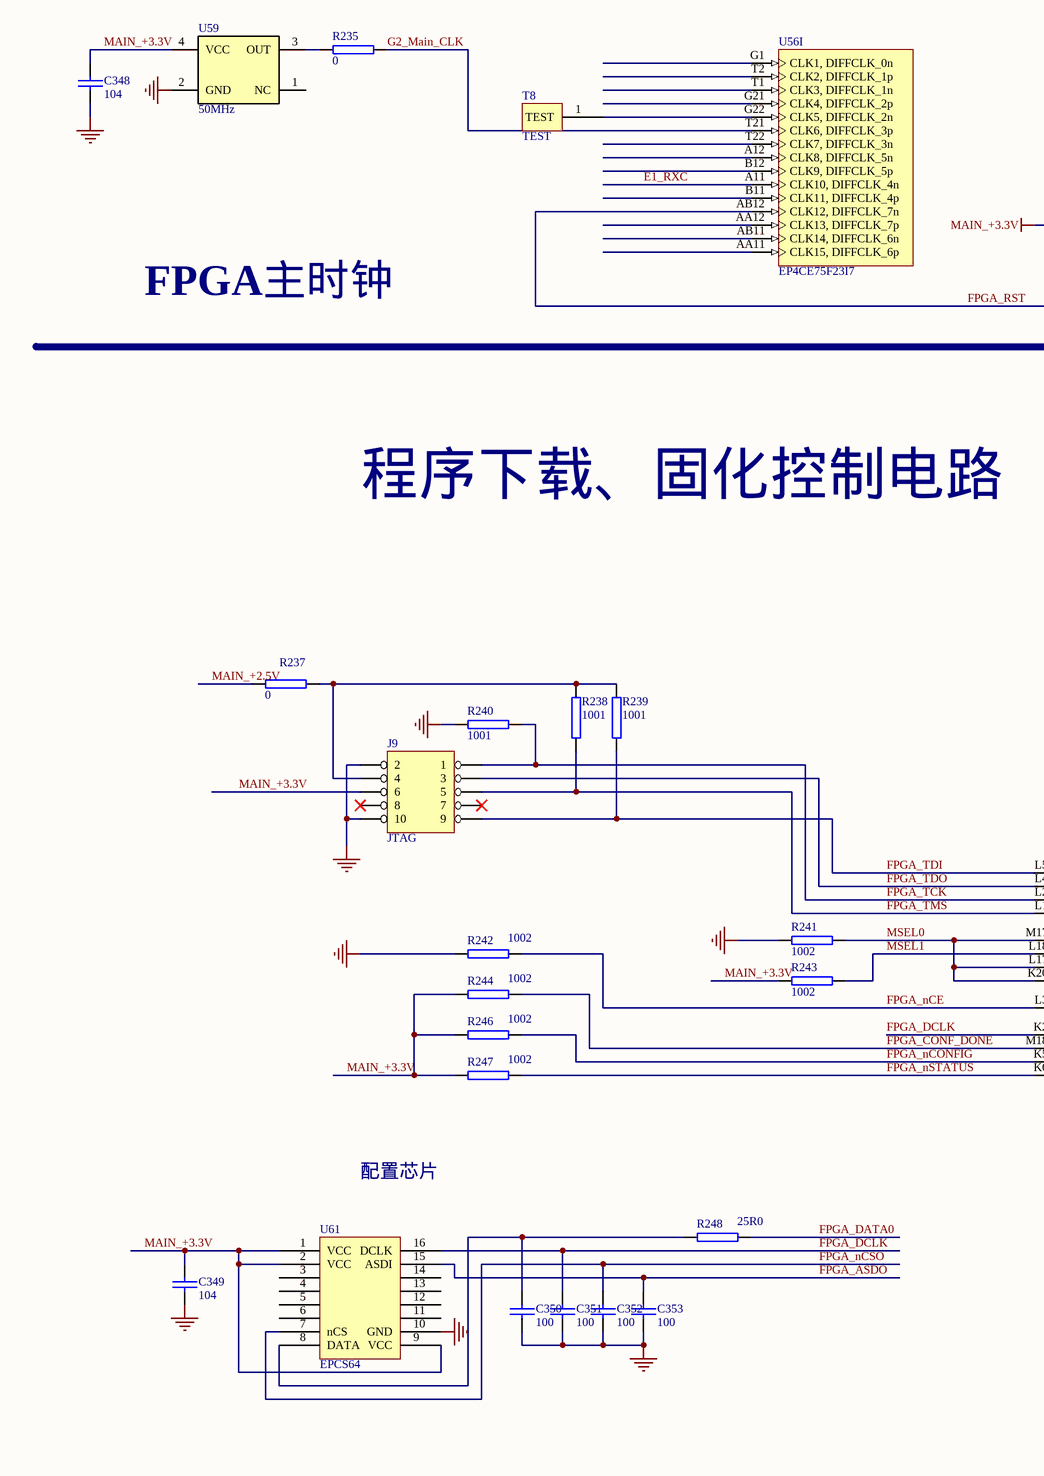
[diagram p5: EP4CE75.SchDoc, bottom left]
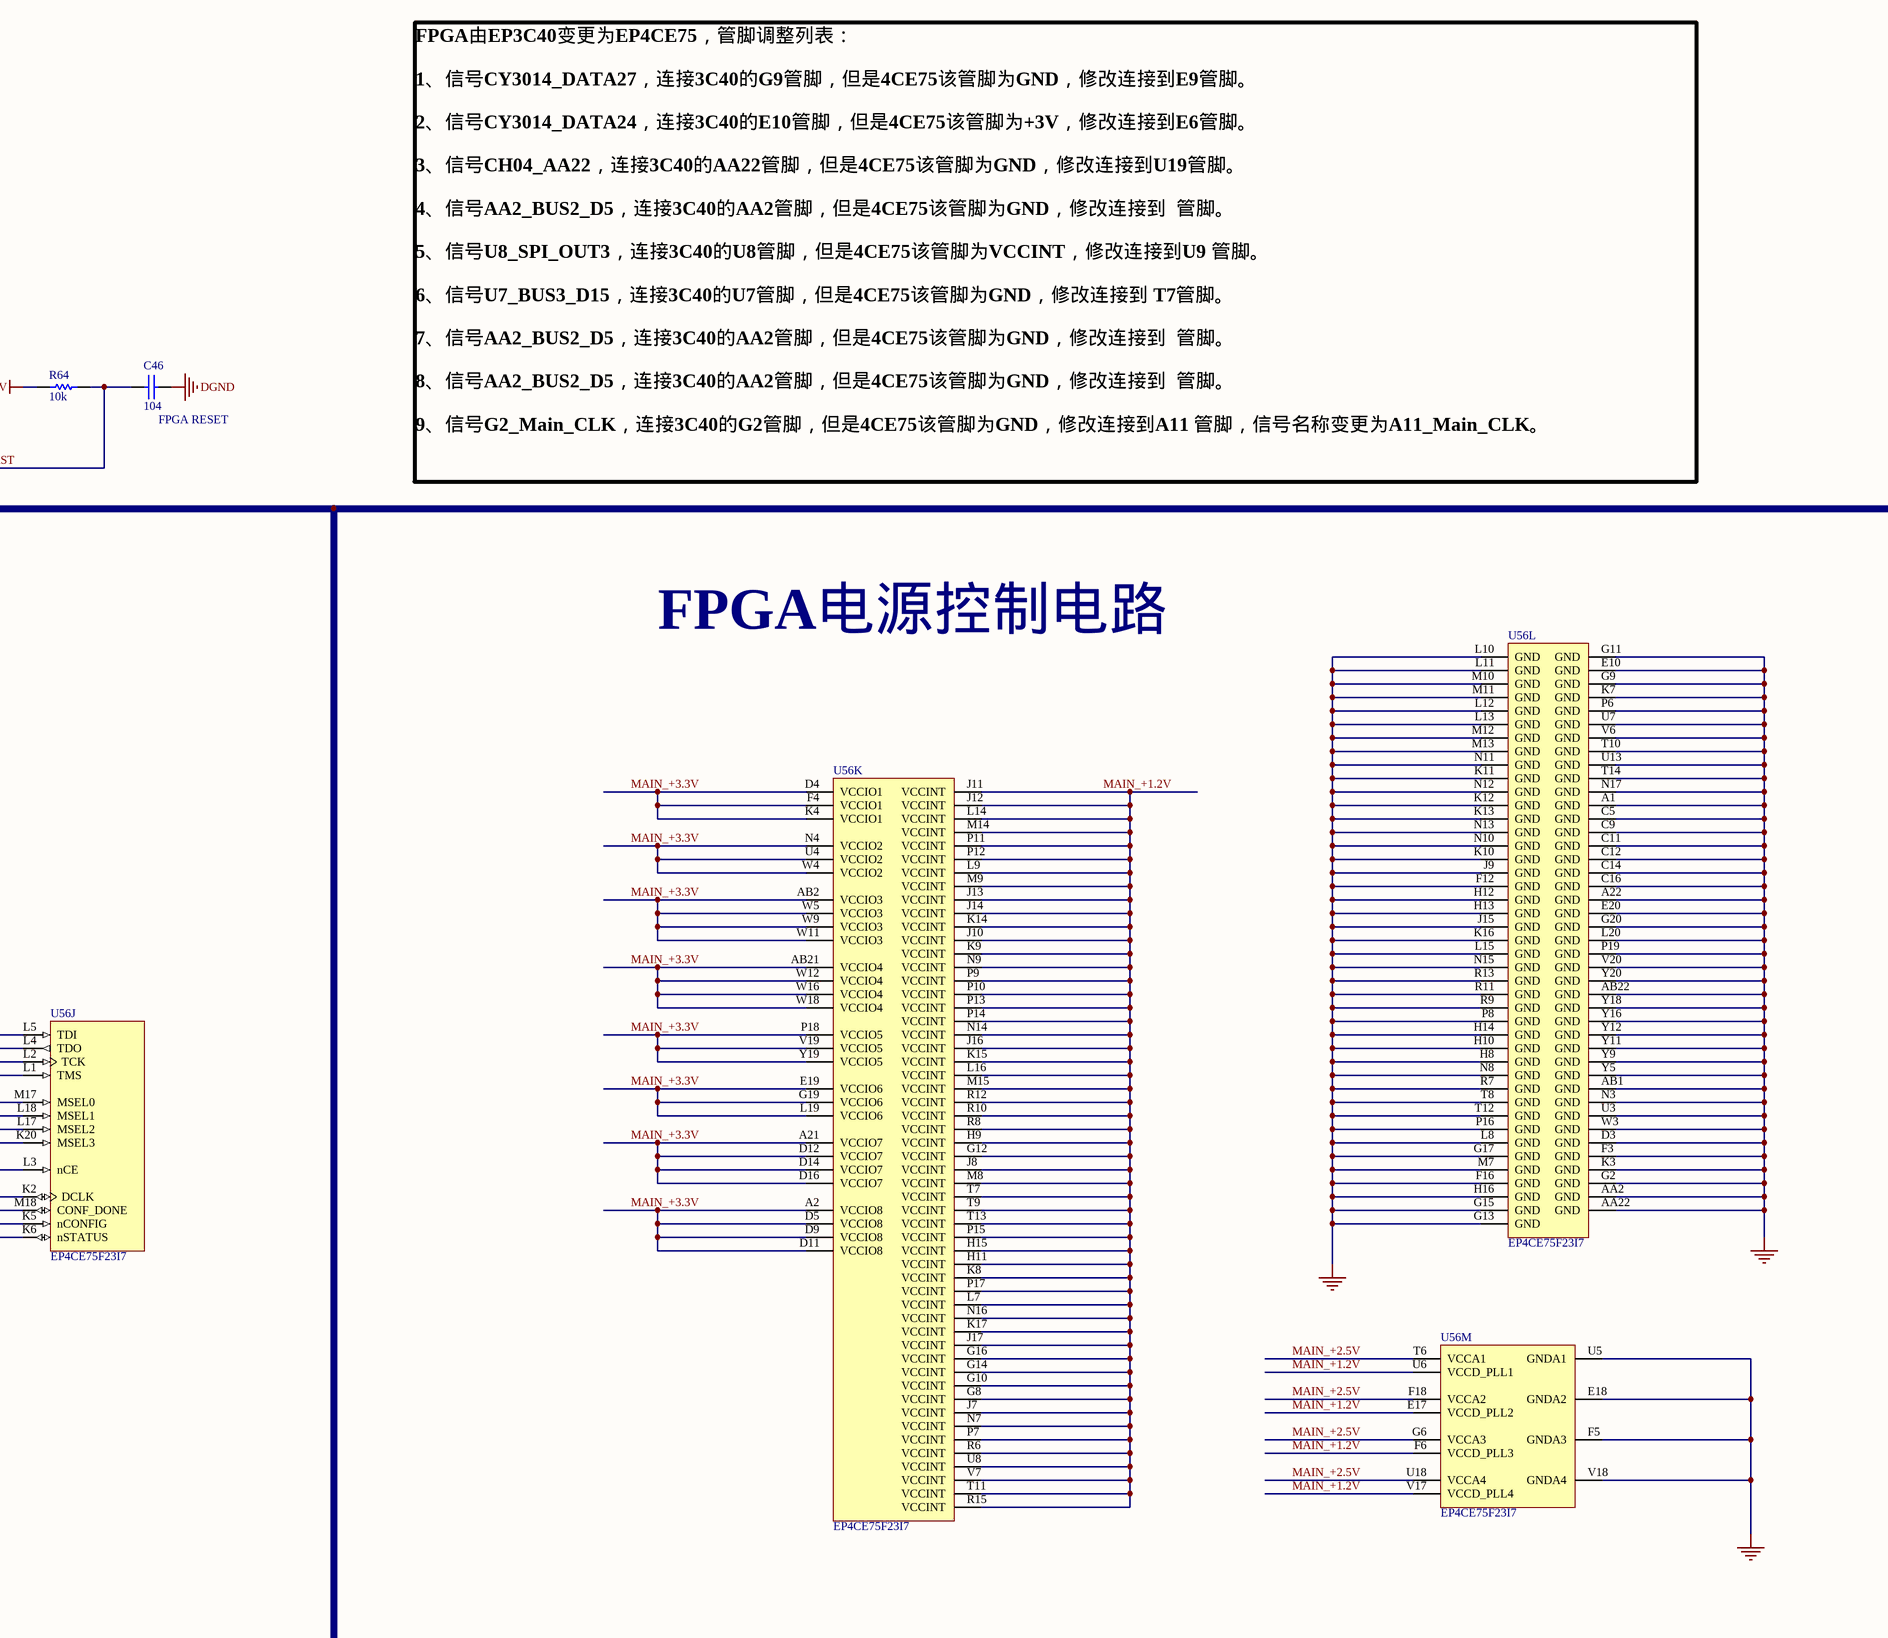
[diagram p6: EP4CE75.SchDoc, bottom middle]
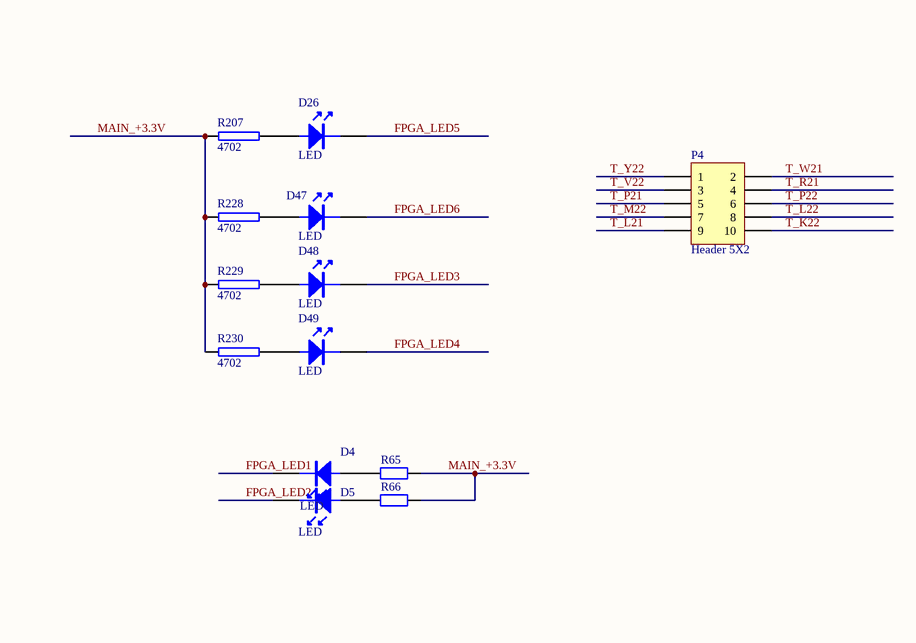
[diagram p7: EP4CE75.SchDoc, bottom right]

### Parts
C46  104  [0805C]
C348  104  [0805C]
C349  104  [0805C]
C350  100  [0805C]
C351  100  [0805C]
C352  100  [0805C]
C353  100  [0805C]
D4  LED  [0805_LED]
D5  LED  [0805_LED]
D26  LED  [0805_LED]
D47  LED  [0805_LED]
D48  LED  [0805_LED]
D49  LED  [0805_LED]
J9  JTAG  [IDC10]
P4  Header 5X2  [HDR2X5]
R64  10k  [0805R]
R65  4701  [0805R]  (value not drawn)
R66  4701  [0805R]  (value not drawn)
R207  4702  [0805R]
R228  4702  [0805R]
R229  4702  [0805R]
R230  4702  [0805R]
R235  0  [0805R]
R237  0  [0805R]
R238  1001  [0805R]
R239  1001  [0805R]
R240  1001  [0805R]
R241  1002  [0805R]
R242  1002  [0402]
R243  1002  [0805R]
R244  1002  [0402]
R246  1002  [0402]
R247  1002  [0402]
R248  25R0  [0805R]
T3  TEST  [TEST_MINI]
T4  TEST  [TEST_MINI]
T5  TEST  [TEST_MINI]
T6  TEST  [TEST_MINI]
T7  TEST  [TEST_MINI]
T8  TEST  [TEST_MINI]
U56  EP4CE75F23I7  [FBGA484-3]  (parts A,B,C,D,E,F,G,H,I,J,K,L,M of 13)
U59  50MHz  [CLOCK4]
U61  EPCS64  [EPCS64_SOIC16]

### Nets
DGND: C46.2 C348.1 C349.1 C350.1 C351.1 C352.1 C353.1 J9.2 J9.10 R240.1 R241.1 R242.2 U56.A1(GND) U56.A22(GND) U56.AA2(GND) U56.AA22(GND) U56.AB1(GND) U56.AB22(GND) U56.C5(GND) U56.C9(GND) U56.C11(GND) U56.C12(GND) U56.C14(GND) U56.C16(GND) U56.D3(GND) U56.E10(GND) U56.E18(GNDA2) U56.E20(GND) U56.F3(GND) U56.F5(GNDA3) U56.F12(GND) U56.F16(GND) U56.G2(GND) U56.G9(GND) U56.G11(GND) U56.G13(GND) U56.G15(GND) U56.G17(GND) U56.G20(GND) U56.H8(GND) U56.H10(GND) U56.H12(GND) U56.H13(GND) U56.H14(GND) U56.H16(GND) U56.J9(GND) U56.J15(GND) U56.K3(GND) U56.K7(GND) U56.K10(GND) U56.K11(GND) U56.K12(GND) U56.K13(GND) U56.K16(GND) U56.L8(GND) U56.L10(GND) U56.L11(GND) U56.L12(GND) U56.L13(GND) U56.L15(GND) U56.L20(GND) U56.M7(GND) U56.M10(GND) U56.M11(GND) U56.M12(GND) U56.M13(GND) U56.N3(GND) U56.N8(GND) U56.N10(GND) U56.N11(GND) U56.N12(GND) U56.N13(GND) U56.N15(GND) U56.N17(GND) U56.P6(GND) U56.P8(GND) U56.P16(GND) U56.P19(GND) U56.R7(GND) U56.R9(GND) U56.R11(GND) U56.R13(GND) U56.T8(GND) U56.T10(GND) U56.T12(GND) U56.T14(GND) U56.U3(GND) U56.U5(GNDA1) U56.U7(GND) U56.U13(GND) U56.V6(GND) U56.V18(GNDA4) U56.V20(GND) U56.W3(GND) U56.Y5(GND) U56.Y9(GND) U56.Y11(GND) U56.Y12(GND) U56.Y16(GND) U56.Y18(GND) U56.Y20(GND) U59.2(GND) U61.10(GND)
MAIN_+3.3V: C348.2 C349.2 J9.6 R64.2 R65.2 R66.2 R207.2 R228.2 R229.2 R230.2 R243.1 R244.1 R246.2 R247.2 U56.A2(VCCIO8) U56.A21(VCCIO7) U56.AB2(VCCIO3) U56.AB21(VCCIO4) U56.D4(VCCIO1) U56.D5(VCCIO8) U56.D9(VCCIO8) U56.D11(VCCIO8) U56.D12(VCCIO7) U56.D14(VCCIO7) U56.D16(VCCIO7) U56.E19(VCCIO6) U56.F4(VCCIO1) U56.G19(VCCIO6) U56.K4(VCCIO1) U56.L19(VCCIO6) U56.N4(VCCIO2) U56.P18(VCCIO5) U56.U4(VCCIO2) U56.V19(VCCIO5) U56.W4(VCCIO2) U56.W5(VCCIO3) U56.W9(VCCIO3) U56.W11(VCCIO3) U56.W12(VCCIO4) U56.W16(VCCIO4) U56.W18(VCCIO4) U56.Y19(VCCIO5) U59.4(VCC) U61.1(VCC) U61.2(VCC) U61.9(VCC)  [project net CH_+3.3V]
CMD_BUS: U56.Y1(IO,_DIFFIO_L32n,_(DQ3L)/(DQ3L)/(DQ1L))
D_READ_CLK: U56.AB19(IO,_RDN2)
D_SPI_DATA: U56.N22(IO,_DIFFIO_R23n,_(DEV_OE))
D_START_AD: U56.M21(IO,_DIFFIO_R22p,_(DQ1R)/(DQ3R)/(DQ1R))
E1_COL: U56.B9(IO,_DIFFIO_T22p,_(PADD17),_(DQS5T/CQ5T#,DPCLK10)/(DQS5T/CQ5T#,DPCLK10)/(DQS5T/CQ5T#,DPCLK10))
E1_CRS: U56.A9(IO,_DIFFIO_T22n,_(PADD16),_(DQ5T)/(DQ3T)/(DQ5T))
E1_GTXC: U56.A13(IO,_DIFFIO_T26n,_(PADD11),_(DQ4T)/(DQ5T)/(DQ5T))
E1_MDC: U56.C19(IO,_DIFFIO_T42n,_(DQ2T)/(DQ5T)/(DQ5T))
E1_MDIO: U56.A20(IO,_PLL2_CLKOUTn)
E1_RESET: U56.B13(IO,_DIFFIO_T26p,_(PADD12),_(DQS4T/CQ5T,DPCLK9)/(DQS4T/CQ5T,DPCLK9)/(DQS4T/CQ5T,DPCLK9))
E1_RXC: U56.A11(CLK10,_DIFFCLK_4n)
E1_RXD0: U56.A4(IO,_DIFFIO_T10n,_(DQ3T)/(DQ3T)/(DQ5T))
E1_RXD1: U56.B4(IO,_DIFFIO_T10p,_(DATA8),_(DQ3T)/(DQ3T)/(DQ5T))
E1_RXD2: U56.A5(IO,_DIFFIO_T13p,_(DATA5),_(DQ3T)/(DQ3T)/(DQ5T))
E1_RXD3: U56.A6(IO,_DIFFIO_T17n,_(PADD19),_(DQ5T)/(DQ3T)/(DQ5T))
E1_RXD4: U56.A10(IO,_DIFFIO_T23n,_(DQ5T)/(DQ3T)/(DQ5T))
E1_RXD5: U56.B10(IO,_DIFFIO_T23p,_(PADD15))
E1_RXD6: U56.A8(IO,_DIFFIO_T19n,_(DATA2),_(DQ5T)/(DQ3T)/(DQ5T))
E1_RXD7: U56.B8(IO,_DIFFIO_T19p,_(DATA3),_(DQ5T)/(DQ3T)/(DQ5T))
E1_RXDV: U56.A3(IO,_DIFFIO_T7n,_(DATA10),_(DQ3T)/(DQ3T)/(DQ5T))
E1_RXER: U56.A7(IO,_DIFFIO_T18n,_(PADD18),_(DQ5T)/(DQ3T)/(DQ5T))
E1_TXC: U56.B14(IO,_DIFFIO_T27p,_(PADD10),_(DQ4T)/(DQ5T)/(DQ5T))
E1_TXD0: U56.B16(IO,_DIFFIO_T35p,_(DQ4T)/(DQ5T)/(DQ5T))
E1_TXD1: U56.A16(IO,_DIFFIO_T35n,_(DM2T)/(DM5T/BWS#5T)/(DM5T/BWS#5T))
E1_TXD2: U56.B17(IO,_DIFFIO_T36p,_(PADD2),_(_)/(DQ5T)/(DQ5T))
E1_TXD3: U56.A17(IO,_DIFFIO_T36n,_(PADD1),_(DQ2T)/(DQ5T)/(DQ5T))
E1_TXD4: U56.B18(IO,_DIFFIO_T39p,_(PADD0))
E1_TXD5: U56.A18(IO,_DIFFIO_T39n,_(DQ2T)/(DQ5T)/(DQ5T))
E1_TXD6: U56.B19(IO,_RUP4)
E1_TXD7: U56.A19(IO,_RDN4)
E1_TXEN: U56.A15(IO,_DIFFIO_T32n,_(PADD5),_(DQ4T)/(DQ5T)/(DQ5T))
E1_TXER: U56.B20(IO,_PLL2_CLKOUTp)
FPGA_ASDO: C353.2 U56.D1(IO,_DIFFIO_L5n,_(DATA1,ASDO)) U61.15(ASDI)
FPGA_CONF_DONE: R244.2 U56.M18(CONF_DONE)
FPGA_DATA0: R248.1 U56.K1(IO,_(DATA0))
FPGA_DCLK: C351.2 U56.K2(DCLK) U61.16(DCLK)
FPGA_LED1: D4.2(K) U56.AA1(IO,_DIFFIO_L33n,_(DQ3L)/(DQ3L)/(DQ1L))
FPGA_LED2: D5.2(K) U56.Y21(IO,_DIFFIO_R40p)
FPGA_LED3: D48.2(K) U56.C1(IO,_DIFFIO_L4n,_(DQ2L)/(DQ1L)/(DQ1L))
FPGA_LED4: D49.2(K) U56.C2(IO,_DIFFIO_L4p,_(DQS2L/CQ3L,CDPCLK0)/(DQS2L/CQ3L,CDPCLK0)/(DQS2L/CQ3L,CDPCLK0))
FPGA_LED5: D26.2(K) U56.B1(IO,_DIFFIO_L2n,_(DQ2L)/(DQ1L)/(DQ1L))
FPGA_LED6: D47.2(K) U56.B2(IO,_DIFFIO_L2p,_(DQ2L)/(DQ1L)/(DQ1L))
FPGA_nCE: R242.1 U56.L3(nCE)
FPGA_nCONFIG: R246.1 U56.K5(nCONFIG)
FPGA_nCSO: C352.2 U56.E2(IO,_DIFFIO_L8p,_(FLASH_nCE,nCSO)) U61.7(nCS)
FPGA_nSTATUS: R247.1 U56.K6(nSTATUS)
FPGA_RST: C46.1 R64.1 U56.AB12(CLK12,_DIFFCLK_7n)
FPGA_TCK: J9.1 R240.2 U56.L2(TCK)
FPGA_TDI: J9.9 R239.1 U56.L5(TDI)
FPGA_TDO: J9.3 U56.L4(TDO)
FPGA_TMS: J9.5 R238.1 U56.L1(TMS)
G2_Main_CLK: R235.2 U56.T21(CLK6,_DIFFCLK_3p)
J2: U56.J2(IO,_DIFFIO_L17p,_(DQ0L)/(DQ1L)/(DQ1L))
L22: U56.N21(IO,_DIFFIO_R23p,_(DEV_CLRn))
MAIN_+1.2V: U56.E17(VCCD_PLL2) U56.F6(VCCD_PLL3) U56.G8(VCCINT) U56.G10(VCCINT) U56.G12(VCCINT) U56.G14(VCCINT) U56.G16(VCCINT) U56.H9(VCCINT) U56.H11(VCCINT) U56.H15(VCCINT) U56.J7(VCCINT) U56.J8(VCCINT) U56.J10(VCCINT) U56.J11(VCCINT) U56.J12(VCCINT) U56.J13(VCCINT) U56.J14(VCCINT) U56.J16(VCCINT) U56.J17(VCCINT) U56.K8(VCCINT) U56.K9(VCCINT) U56.K14(VCCINT) U56.K15(VCCINT) U56.K17(VCCINT) U56.L7(VCCINT) U56.L9(VCCINT) U56.L14(VCCINT) U56.L16(VCCINT) U56.M8(VCCINT) U56.M9(VCCINT) U56.M14(VCCINT) U56.M15(VCCINT) U56.N7(VCCINT) U56.N9(VCCINT) U56.N14(VCCINT) U56.N16(VCCINT) U56.P7(VCCINT) U56.P9(VCCINT) U56.P10(VCCINT) U56.P11(VCCINT) U56.P12(VCCINT) U56.P13(VCCINT) U56.P14(VCCINT) U56.P15(VCCINT) U56.P17(VCCINT) U56.R6(VCCINT) U56.R8(VCCINT) U56.R10(VCCINT) U56.R12(VCCINT) U56.R15(VCCINT) U56.T7(VCCINT) U56.T9(VCCINT) U56.T11(VCCINT) U56.T13(VCCINT) U56.U6(VCCD_PLL1) U56.U8(VCCINT) U56.V7(VCCINT) U56.V17(VCCD_PLL4)
MAIN_+2.5V: R237.1 U56.F18(VCCA2) U56.G6(VCCA3) U56.T6(VCCA1) U56.U18(VCCA4)
Main_Data: U56.AB5(IO,_DIFFIO_B6n)
Main_Data_1: U56.W1(IO,_DIFFIO_L31n,_(DQ3L)/(DQ3L)/(DQ1L))
MSEL0: R241.2 U56.K20(MSEL3) U56.L17(MSEL2) U56.M17(MSEL0)
MSEL1: R243.2 U56.L18(MSEL1)
PA0: U56.AB17(IO,_DIFFIO_B39n)
PA1: U56.AA16(IO,_DIFFIO_B32p,_(DM2B)/(DM5B/BWS#5B)/(DM5B/BWS#5B))
PA2: U56.AB16(IO,_DIFFIO_B32n,_(DQ2B)/(DQ5B)/(DQ5B))
PA3: U56.AA15(IO,_DIFFIO_B29p,_(DQ4B)/(DQ5B)/(DQ5B))
PA4: U56.AB15(IO,_DIFFIO_B29n,_(DQ4B)/(DQ5B)/(DQ5B))
PA5: U56.AA14(IO,_DIFFIO_B27p,_(DQ4B)/(DQ5B)/(DQ5B))
PA6: U56.AB14(IO,_DIFFIO_B27n,_(DQ4B)/(DQ5B)/(DQ5B))
PA7: U56.AA13(IO,_DIFFIO_B25p,_(DQ4B)/(DQ5B)/(DQ5B))
PB0: U56.AB10(IO,_DIFFIO_B23n,_(_)/(DQ5B)/(DQ5B))
PB1: U56.AA9(IO,_DIFFIO_B18p,_(DQ5B)/(DQ3B)/(DQ5B))
PC0: U56.AA21(IO,_DIFFIO_R41p,_(DM3R/BWS#3R)/(DM3R/BWS#3R)/(DM1R/BWS#1R))
PC1: U56.AB20(IO,_DIFFIO_B41n,_(DQ2B)/(DQ5B)/(DQ5B))
PC2: U56.AB18(IO,_(DQ2B)/(DQ5B)/(DQ5B))
PC3: U56.AA17(IO,_DIFFIO_B39p)
PC4: U56.AB13(IO,_DIFFIO_B25n,_(DQ4B)/(DQ5B)/(DQ5B))
PC5: U56.AA10(IO,_DIFFIO_B23p,_(DM4B)/(DM5B/BWS#5B)/(DM5B/BWS#5B))
PC7: U56.U20(IO,_DIFFIO_R39n,_(DQ3R)/(DQ3R)/(DQ1R))
PC8: U56.U19(IO,_DIFFIO_R39p)
PC9: U56.W22(IO,_DIFFIO_R37n,_(DQ3R)/(DQ3R)/(DQ1R))
PC11: U56.T20(IO,_DIFFIO_R36n)
PC12: U56.T19(IO,_DIFFIO_R36p)
PC13: U56.R17(IO,_DIFFIO_R35n)
PC15: U56.V21(IO,_DIFFIO_R34p,_(DQ3R)/(DQ3R)/(DQ1R))
SPI1_CLK: U56.C22(IO,_DIFFIO_R6n,_(DQ2R)/(DQ1R)/(DQ1R))
SPI1_CS0: U56.B21(IO,_DIFFIO_R5p,_(PADD21),_(DQ2R)/(DQ1R)/(DQ1R))
SPI1_MISO: U56.B22(IO,_DIFFIO_R5n,_(PADD22),_(DQ2R)/(DQ1R)/(DQ1R))
SPI1_MISO_ARM: U56.AA8(IO,_DIFFIO_B17p,_(DQ5B)/(DQ3B)/(DQ5B))
SPI1_MOSI: U56.C21(IO,_DIFFIO_R6p,_(DQ2R)/(DQ1R)/(DQ1R))
SPI1_MOSI_ARM: U56.AB7(IO,_DIFFIO_B10n,_(DQ5B)/(DQ3B)/(DQ5B))
SPI1_NSS_ARM: U56.AB9(IO,_DIFFIO_B18n,_(DQS5B/CQ5B#,DPCLK3)/(DQS5B/CQ5B#,DPCLK3)/(DQS5B/CQ5B#,DPCLK3))
SPI1_SCK_ARM: U56.AB8(IO,_DIFFIO_B17n,_(DQ5B)/(DQ3B)/(DQ5B))
SPI2_CS1: U56.E22(IO,_DIFFIO_R11n,_(nWE),_(DQ0R)/(DQ1R)/(DQ1R))
SPI2_MISO: U56.D21(IO,_DIFFIO_R10p,_(_)/(DQ1R)/(DQ1R))
SPI2_MOSI: U56.E21(IO,_DIFFIO_R11p,_(nOE),_(_)/(DQ1R)/(DQ1R))
SPI2_SCLK: U56.D22(IO,_DIFFIO_R10n,_(DM2R)/(DM1R/BWS#1R)/(DM1R/BWS#1R))
T_K22: P4.10 U56.K22(IO,_DIFFIO_R19n,_(nCEO))
T_L21: P4.9 U56.L21(IO,_DIFFIO_R20p,_(CRC_ERROR))
T_L22: P4.8 U56.L22(IO,_DIFFIO_R20n,_(INIT_DONE))
T_M22: P4.7 U56.M22(IO,_DIFFIO_R22n,_(DQ1R)/(DQ3R)/(DQ1R))
T_P21: P4.5 U56.P21(IO,_DIFFIO_R27p,_(DQ1R)/(DQ3R)/(DQ1R))
T_P22: P4.6 U56.P22(IO,_DIFFIO_R27n,_(DQ1R)/(DQ3R)/(DQ1R))
T_R21: P4.4 U56.R21(IO,_DIFFIO_R29p,_(DQ1R)/(DQ3R)/(DQ1R))
T_V22: P4.3 U56.V22(IO,_DIFFIO_R34n,_(DQ3R)/(DQ3R)/(DQ1R))
T_W21: P4.2 U56.W21(IO,_DIFFIO_R37p,_(DQ3R)/(DQ3R)/(DQ1R))
T_Y22: P4.1 U56.Y22(IO,_DIFFIO_R40n,_(DQ3R)/(DQ3R)/(DQ1R))
TIME_MK_IN: U56.AB6(IO,_DIFFIO_B6p)
TIME_MK_OUT: U56.M1(IO,_DIFFIO_L20n,_(_)/(DQ1L)/(DQ1L))
NetC350_2: C350.2 R248.2 U61.8(DATA)
NetD4_1: D4.1(A) R65.1
NetD5_1: D5.1(A) R66.1
NetD26_1: D26.1(A) R207.1
NetD47_1: D47.1(A) R228.1
NetD48_1: D48.1(A) R229.1
NetD49_1: D49.1(A) R230.1
NetJ9_4: J9.4 R237.2 R238.2 R239.2
NetR235_1: R235.1 U59.3(OUT)
NetT3_1: T3.1(TEST) U56.U1(IO,_DIFFIO_L27n,_(DQ3L)/(DQ3L)/(DQ1L))
NetT4_1: T4.1(TEST) U56.P1(IO,_DIFFIO_L23n,_(DQ1L)/(DQ3L)/(DQ1L))
NetT5_1: T5.1(TEST) U56.V1(IO,_DIFFIO_L28n,_(DQ3L)/(DQ3L)/(DQ1L))
NetT6_1: T6.1(TEST) U56.F1(IO,_DIFFIO_L9n,_(DQ0L)/(DQ1L)/(DQ1L))
NetT7_1: T7.1(TEST) U56.F20(IO,_DIFFIO_R9n,_(nAVD),_(DQ2R)/(DQ1R)/(DQ1R))
NetT8_1: T8.1(TEST) U56.G22(CLK5,_DIFFCLK_2n)

Not connected (* = marked no-connect by the designer): J9 7* 8*; U56 A12(CLK8,_DIFFCLK_5n) A14(IO,_DIFFIO_T27n,_(PADD9),_(DQ4T)/(DQ5T)/(DQ5T)) AA3(IO,_PLL1_CLKOUTp) AA4(IO,_(DQ3B)/(DQ3B)/(DQ5B)) AA5(IO,_DIFFIO_B5p,_(DQ3B)/(DQ3B)/(DQ5B)) AA6(IO,_DIFFIO_B5n) AA7(IO,_DIFFIO_B10p,_(DM5B/BWS#5B)/(DM3B/BWS#3B)/(DM5B/BWS#5B)) AA11(CLK15,_DIFFCLK_6p) AA12(CLK13,_DIFFCLK_7p) AA18(IO,_VREFB4N1) AA19(IO,_RUP2) AA20(IO,_DIFFIO_B41p,_(_)/(DQ5B)/(DQ5B)) AB3(IO,_PLL1_CLKOUTn) AB4(IO,_VREFB3N2) AB11(CLK14,_DIFFCLK_6n) B3(IO,_DIFFIO_T7p,_(DATA11),_(DQ3T)/(DQ3T)/(DQ5T)) B5(IO,_VREFB8N1) B6(IO,_DIFFIO_T17p,_(DATA15),_(DQ5T)/(DQ3T)/(DQ5T)) B7(IO,_DIFFIO_T18p,_(DATA4),_(DQ5T)/(DQ3T)/(DQ5T)) B11(CLK11,_DIFFCLK_4p) B12(CLK9,_DIFFCLK_5p) B15(IO,_DIFFIO_T32p,_(PADD6),_(DQ4T)/(DQ5T)/(DQ5T)) C3(IO,_DIFFIO_T3n,_(DQ3T)/(DQ3T)/(DQ5T)) C4(IO,_DIFFIO_T3p,_(DATA12),_(DQS1T/CQ1T#,CDPCLK7)/(DQS1T/CQ1T#,CDPCLK7)/(DQS1T/CQ1T#,CDPCLK7)) C6(IO,_DIFFIO_T11n,_(DATA7),_(DQ3T)/(DQ3T)/(DQ5T)) C7(IO,_DIFFIO_T15p,_(DATA13),_(DM5T/BWS#5T)/(DM3T/BWS#3T)/(DM5T/BWS#5T)) C8(IO,_DIFFIO_T15n,_(DATA14),_(DQS3T/CQ3T#,DPCLK11)/(DQS3T/CQ3T#,DPCLK11)/(DQS3T/CQ3T#,DPCLK11)) C10(IO,_VREFB8N0) C13(IO,_DIFFIO_T31n,_(PADD7)) C15(IO,_VREFB7N1) C17(IO,_DIFFIO_T40p,_(DQ2T)/(DQ5T)/(DQ5T)) C18(IO,_DIFFIO_T44n) C20(IO,_DIFFIO_R4n,_(PADD20),_(DQS2R/CQ3R,CDPCLK5)/(DQS2R/CQ3R,CDPCLK5)/(DQS2R/CQ3R,CDPCLK5)) D2(IO,_DIFFIO_L5p,_(DQ2L)/(DQ1L)/(DQ1L)) D6(IO,_VREFB8N2) D7(IO,_DIFFIO_T11p) D8(IO,_DIFFIO_T14n) D10(IO,_DIFFIO_T24n,_(DQ5T)/(DQ3T)/(DQ5T)) D13(IO,_DIFFIO_T31p,_(PADD8),_(DQ4T)/(DQ5T)/(DQ5T)) D15(IO,_DIFFIO_T38n) D17(IO,_VREFB7N0) D18(IO,_DIFFIO_T44p) D19(IO,_DIFFIO_T42p,_(DQ2T)/(DQ5T)/(DQ5T)) D20(IO,_VREFB6N0) E1(IO,_DIFFIO_L8n,_(_)/(DQ1L)/(DQ1L)) E3(IO,_DIFFIO_L3n,_(DQ2L)/(DQ1L)/(DQ1L)) E4(IO,_DIFFIO_L3p,_(nRESET),_(DQ2L)/(DQ1L)/(DQ1L)) E5(IO,_PLL3_CLKOUTp) E6(IO,_PLL3_CLKOUTn) E7(IO,_DIFFIO_T6n) E8(IO,_DIFFIO_T14p) E9(IO,_DIFFIO_T16n) E11(IO,_DIFFIO_T25n,_(PADD13)) E12(IO,_(_)/(DQ5T)/(DQ5T)) E13(IO,_VREFB7N2) E14(IO,_DIFFIO_T33n,_(PADD3),_(DQ4T)/(DQ5T)/(DQ5T)) E15(IO,_DIFFIO_T38p,_(DQ2T)/(DQ5T)/(DQ5T)) E16(IO,_DIFFIO_T46n,_(DQ2T)/(DQ5T)/(DQ5T)) F2(IO,_DIFFIO_L9p,_(DM2L)/(DM1L/BWS#1L)/(DM1L/BWS#1L)) F7(IO,_DIFFIO_T2n,_(DM3T/BWS#3T)/(DM3T/BWS#3T)/(DM5T/BWS#5T)) F8(IO,_DIFFIO_T9n,_(DATA9),_(DQ3T)/(DQ3T)/(DQ5T)) F9(IO) F10(IO,_DIFFIO_T12p,_(DATA6),_(DQ3T)/(DQ3T)/(DQ5T)) F11(IO,_DIFFIO_T25p,_(PADD14),_(DM4T)/(DM5T/BWS#5T)/(DM5T/BWS#5T)) F13(IO,_DIFFIO_T33p,_(PADD4),_(DQS2T/CQ3T,DPCLK8)/(DQS2T/CQ3T,DPCLK8)/(DQS2T/CQ3T,DPCLK8)) F14(IO,_DIFFIO_T45p,_(DQS0T/CQ1T,CDPCLK6)/(DQS0T/CQ1T,CDPCLK6)/(DQS0T/CQ1T,CDPCLK6)) F15(IO,_DIFFIO_T46p,_(DQ2T)/(DQ5T)/(DQ5T)) F17(IO,_DIFFIO_R1n,_(DQ2R)/(DQ1R)/(DQ1R)) F19(IO,_DIFFIO_R9p,_(DQ2R)/(DQ1R)/(DQ1R)) F21(IO,_DIFFIO_R14p,_(DQ0R)/(DQ1R)/(DQ1R)) F22(IO,_DIFFIO_R14n,_(DQ0R)/(DQ1R)/(DQ1R)) G1(CLK1,_DIFFCLK_0n) G3(IO,_DIFFIO_L1n) G4(IO,_DIFFIO_L1p) G5(IO,_VREFB1N0) G7(IO,_DIFFIO_T2p) G18(IO,_DIFFIO_R8n,_(PADD23),_(DQ2R)/(DQ1R)/(DQ1R)) G21(CLK4,_DIFFCLK_2p) H1(IO,_DIFFIO_L13n,_(DQ0L)/(DQ1L)/(DQ1L)) H2(IO,_DIFFIO_L13p,_(DQ0L)/(DQ1L)/(DQ1L)) H3(IO,_DIFFIO_L7n) H4(IO,_DIFFIO_L7p) H5(IO,_VREFB1N1) H6(IO,_DIFFIO_L6p,_(DQ2L)/(DQ1L)/(DQ1L)) H7(IO) H17(IO,_DIFFIO_R8p) H18(IO,_VREFB6N1) H19(IO,_DIFFIO_R12p,_(DQ0R)/(DQ1R)/(DQ1R)) H20(IO,_DIFFIO_R12n,_(DQ0R)/(DQ1R)/(DQ1R)) H21(IO,_DIFFIO_R17p,_(DQ0R)/(DQ1R)/(DQ1R)) H22(IO,_DIFFIO_R17n,_(DQ0R)/(DQ1R)/(DQ1R)) J1(IO,_DIFFIO_L17n,_(DQ0L)/(DQ1L)/(DQ1L)) J3(IO,_VREFB1N2) J4(IO,_DIFFIO_L12p,_(DQS0L/CQ1L,DPCLK0)/(DQS0L/CQ1L,DPCLK0)/(DQS0L/CQ1L,DPCLK0)) J5(IO) J6(IO,_DIFFIO_L6n,_(DQ2L)/(DQ1L)/(DQ1L)) J18(IO,_DIFFIO_R16p) J19(IO,_DIFFIO_R13p) J20(IO,_DIFFIO_R13n) J21(IO,_DIFFIO_R18p,_(DM0R)/(DM1R/BWS#1R)/(DM1R/BWS#1R)) J22(IO,_DIFFIO_R18n,_(DQS0R/CQ1R,DPCLK7)/(DQS0R/CQ1R,DPCLK7)/(DQS0R/CQ1R,DPCLK7)) K18(IO,_DIFFIO_R16n,_(DQ0R)/(DQ1R)/(DQ1R)) K19(IO,_VREFB6N2) K21(IO,_DIFFIO_R19p,_(CLKUSR)) L6(IO,_DIFFIO_L19p,_(DQ0L)/(DQ1L)/(DQ1L)) M2(IO,_DIFFIO_L20p,_(DQ0L)/(DQ1L)/(DQ1L)) M3(IO,_DIFFIO_L21n,_(DQ1L)/(DQ3L)/(DQ1L)) M4(IO,_DIFFIO_L21p,_(DM0L)/(DM1L/BWS#1L)/(DM1L/BWS#1L)) M5(IO,_VREFB2N0) M6(IO,_DIFFIO_L19n,_(DQ0L)/(DQ1L)/(DQ1L)) M16(IO) M19(IO,_DIFFIO_R21p,_(DQ1R)/(DQ3R)/(DQ1R)) M20(IO,_DIFFIO_R21n,_(DQ1R)/(DQ3R)/(DQ1R)) N1(IO,_DIFFIO_L22n,_(DQ1L)/(DQ3L)/(DQ1L)) N2(IO,_DIFFIO_L22p,_(DQ1L)/(DQ3L)/(DQ1L)) N5(IO,_DIFFIO_L25n,_(DQ1L)/(DQ3L)/(DQ1L)) N6(IO,_DIFFIO_L29n,_(DQ3L)/(DQ3L)/(DQ1L)) N18(IO,_DIFFIO_R24p,_(DQS1R/CQ1R#,DPCLK6)/(DQS1R/CQ1R#,DPCLK6)/(DQS1R/CQ1R#,DPCLK6)) N19(IO,_VREFB5N0) N20(IO,_DIFFIO_R25n,_(DQ1R)/(DQ3R)/(DQ1R)) P2(IO,_DIFFIO_L23p,_(DQ1L)/(DQ3L)/(DQ1L)) P3(IO,_DIFFIO_L26n,_(DQ1L)/(DQ3L)/(DQ1L)) P4(IO,_DIFFIO_L26p,_(DQS1L/CQ1L#,DPCLK1)/(DQS1L/CQ1L#,DPCLK1)/(DQS1L/CQ1L#,DPCLK1)) P5(IO,_DIFFIO_L29p) P20(IO,_VREFB5N1) R1(IO,_DIFFIO_L24n,_(DQ1L)/(DQ3L)/(DQ1L)) R2(IO,_DIFFIO_L24p,_(DQ1L)/(DQ3L)/(DQ1L)) R3(IO,_DIFFIO_L30n) R4(IO,_DIFFIO_L30p) R5(IO,_VREFB2N2) R14(IO,_DIFFIO_B45p) R16(IO,_PLL4_CLKOUTn) R18(IO,_DIFFIO_R31n) R19(IO,_DIFFIO_R31p,_(DM1R/BWS#1R)/(DM3R/BWS#3R)/(DM1R/BWS#1R)) R20(IO,_DIFFIO_R33n,_(DQ3R)/(DQ3R)/(DQ1R)) R22(IO,_DIFFIO_R29n,_(DQ1R)/(DQ3R)/(DQ1R)) T1(CLK3,_DIFFCLK_1n) T2(CLK2,_DIFFCLK_1p) T3(IO,_VREFB2N1) T4(IO,_DIFFIO_L35p,_(DQS3L/CQ3L#,CDPCLK1)/(DQS3L/CQ3L#,CDPCLK1)/(DQS3L/CQ3L#,CDPCLK1)) T5(IO,_DIFFIO_L35n,_(DM3L/BWS#3L)/(DM3L/BWS#3L)/(DM1L/BWS#1L)) T15(IO,_DIFFIO_B38n,_(DQ2B)/(DQ5B)/(DQ5B)) T16(IO,_PLL4_CLKOUTp) T17(IO,_RUP3) T18(IO,_RDN3) T22(CLK7,_DIFFCLK_3n) U2(IO,_DIFFIO_L27p,_(DM1L/BWS#1L)/(DM3L/BWS#3L)/(DM1L/BWS#1L)) U9(IO,_DIFFIO_B8p,_(DQ3B)/(DQ3B)/(DQ5B)) U10(IO,_DIFFIO_B16n,_(DQ5B)/(DQ3B)/(DQ5B)) U11(IO,_VREFB3N0) U12(IO,_DIFFIO_B30p,_(DQ4B)/(DQ5B)/(DQ5B)) U14(IO,_DIFFIO_B35n) U15(IO,_DIFFIO_B36p) U16(IO,_DIFFIO_B44p) U17(IO,_DIFFIO_B44n) U21(IO,_DIFFIO_R32p,_(DQ3R)/(DQ3R)/(DQ1R)) U22(IO,_DIFFIO_R32n,_(DQ3R)/(DQ3R)/(DQ1R)) V2(IO,_DIFFIO_L28p,_(DQ3L)/(DQ3L)/(DQ1L)) V3(IO,_RDN1) V4(IO,_RUP1) V5(IO,_DIFFIO_B1n,_(DM3B/BWS#3B)/(DM3B/BWS#3B)/(DM5B/BWS#5B)) V8(IO,_DIFFIO_B8n,_(DQ3B)/(DQ3B)/(DQ5B)) V9(IO,_VREFB3N1) V10(IO,_DIFFIO_B15p,_(DQS3B/CQ3B#,DPCLK2)/(DQS3B/CQ3B#,DPCLK2)/(DQS3B/CQ3B#,DPCLK2)) V11(IO,_(DQ5B)/(DQ3B)/(DQ5B)) V12(IO,_VREFB4N2) V13(IO,_DIFFIO_B33p,_(DQS2B/CQ3B,DPCLK5)/(DQS2B/CQ3B,DPCLK5)/(DQS2B/CQ3B,DPCLK5)) V14(IO,_DIFFIO_B35p,_(DQ2B)/(DQ5B)/(DQ5B)) V15(IO,_DIFFIO_B36n,_(DQ2B)/(DQ5B)/(DQ5B)) V16(IO,_VREFB4N0) W2(IO,_DIFFIO_L31p,_(DQ3L)/(DQ3L)/(DQ1L)) W6(IO,_DIFFIO_B4p,_(DQ3B)/(DQ3B)/(DQ5B)) W7(IO,_DIFFIO_B7p,_(DQ3B)/(DQ3B)/(DQ5B)) W8(IO,_(DQ3B)/(DQ3B)/(DQ5B)) W10(IO,_DIFFIO_B22p,_(DQ5B)/(DQ3B)/(DQ5B)) W13(IO,_DIFFIO_B28p,_(DQ4B)/(DQ5B)/(DQ5B)) W14(IO,_DIFFIO_B33n) W15(IO,_DIFFIO_B37p,_(DQ2B)/(DQ5B)/(DQ5B)) W17(IO,_DIFFIO_B40p,_(DQ2B)/(DQ5B)/(DQ5B)) W19(IO,_VREFB5N2) W20(IO,_(DQS3R/CQ3R#,CDPCLK4)/(DQS3R/CQ3R#,CDPCLK4)/(DQS3R/CQ3R#,CDPCLK4)) Y2(IO,_DIFFIO_L32p,_(DQ3L)/(DQ3L)/(DQ1L)) Y3(IO,_DIFFIO_B3n,_(DQ3B)/(DQ3B)/(DQ5B)) Y4(IO,_DIFFIO_B3p) Y6(IO,_(DQS1B/CQ1B#,CDPCLK2)/(DQS1B/CQ1B#,CDPCLK2)/(DQS1B/CQ1B#,CDPCLK2)) Y7(IO,_DIFFIO_B7n,_(DQ3B)/(DQ3B)/(DQ5B)) Y8(IO,_DIFFIO_B11p,_(DQ5B)/(DQ3B)/(DQ5B)) Y10(IO,_DIFFIO_B22n,_(DQ5B)/(DQ3B)/(DQ5B)) Y13(IO,_DIFFIO_B28n,_(DQS4B/CQ5B,DPCLK4)/(DQS4B/CQ5B,DPCLK4)/(DQS4B/CQ5B,DPCLK4)) Y14(IO,_DIFFIO_B31p) Y15(IO,_DIFFIO_B31n) Y17(IO,_DIFFIO_B40n,_(DQS0B/CQ1B,CDPCLK3)/(DQS0B/CQ1B,CDPCLK3)/(DQS0B/CQ1B,CDPCLK3)); U59 1(NC); U61 3 4 5 6 11 12 13 14

### Notes on the sheet
- (near C46) FPGA RESET
- FPGA主时钟
- FPGA由EP3C40变更为EP4CE75，管脚调整列表：
  1、信号CY3014_DATA27，连接3C40的G9管脚，但是4CE75该管脚为GND，修改连接到E9管脚。
  2、信号CY3014_DATA24，连接3C40的E10管脚，但是4CE75该管脚为+3V，修改连接到E6管脚。
  3、信号CH04_AA22，连接3C40的AA22管脚，但是4CE75该管脚为GND，修改连接到U19管脚。
  4、信号AA2_BUS2_D5，连接3C40的AA2管脚，但是4CE75该管脚为GND，修改连接到  管脚。
  5、信号U8_SPI_OUT3，连接3C40的U8管脚，但是4CE75该管脚为VCCINT，修改连接到U9 管脚。
  6、信号U7_BUS3_D15，连接3C40的U7管脚，但是4CE75该管脚为GND，修改连接到 T7管脚。
  7、信号AA2_BUS2_D5，连接3C40的AA2管脚，但是4CE75该管脚为GND，修改连接到  管脚。
  8、信号AA2_BUS2_D5，连接3C40的AA2管脚，但是4CE75该管脚为GND，修改连接到  管脚。
  9、信号G2_Main_CLK，连接3C40的G2管脚，但是4CE75该管脚为GND，修改连接到A11 管脚，信号名称变更为A11_Main_CLK。
- 程序下载、固化控制电路
- FPGA电源控制电路
- 配置芯片
- Labels drawn without touching a wire or pin: D_DATA8, D_DATA9, PC0, TEST1, TEST2, TEST3, TEST4
- (in symbol EP4CE75F23I7, part A) BANK 1
- (in symbol EP4CE75F23I7, part B) BANK 2
- (in symbol EP4CE75F23I7, part C) BANK 3
- (in symbol EP4CE75F23I7, part D) BANK 4
- (in symbol EP4CE75F23I7, part E) BANK 5
- (in symbol EP4CE75F23I7, part F) BANK 6
- (in symbol EP4CE75F23I7, part G) BANK 7
- (in symbol EP4CE75F23I7, part H) BANK 8

### Library data of the parts
C46 C348 = CAP: Capacitor
C349-C353 = C
J9 = HEADER 5X2
P4 = Header 5X2: Header, 5-Pin, Dual row; LatestRevisionDate: 17-Jul-2002; LatestRevisionNote: Re-released for DXP Platform.; Publisher: Altium Limited
R64 = res1: Resistor; Published: *; Revision: *; Publisher: *; Value: *
R65 R66 = Res2: Resistor; Value: 5K; Published: 8-Jun-2000; LatestRevisionDate: 17-Jul-2002; LatestRevisionNote: Re-released for DXP Platform.; PackageReference: AXIAL-0.4; Publisher: Altium Limited
R207 R228-R230 R235 R237-R244 R246-R248 = RES2
U56 = EP4CE75F23I7: Cyclone IV Family FPGA, 2V Core, 292 I/O Pins, 4 PLLs, 484-Pin FBGA, Speed Grade 7, Industrial Grade; Published: 3-May-2010; DatasheetVersion: ver1.2, Mar-2010; PackageVersion: ver16.0, Dec-2009; PackageReference: FBGA484; Publisher: Altium Limited; PackageDescription: 484-Ball FineLine Ball Grid Array (FBGA484) - Flip Chip; Supplier 1: Digi-Key; Supplier Part Number 1: EP4CE75F23I7-ND; Code_JEDEC: MS-034-AAJ-1; Code_IPC: BGA100P22X22-484; ComponentLink1Description: Manufacturer Link; ComponentLink1URL: http://www.altera.com/; ComponentLink2Description: Handbook; ComponentLink2URL: http://www.altera.com/literature/hb/cyclone-iv/cyclone4-handbook.pdf; ComponentLink3Description: Pinout Specification; ComponentLink3URL: http://www.altera.com/literature/lit-dp.jsp?category=cyc%204&showspreadsheet=y; ComponentLink4Description: Packaging Specification; ComponentLink4URL: http://www.altera.com/literature/ds/dspkg.pdf
U59 = OSC

## Sheet FPGA_PWR.SchDoc
size C
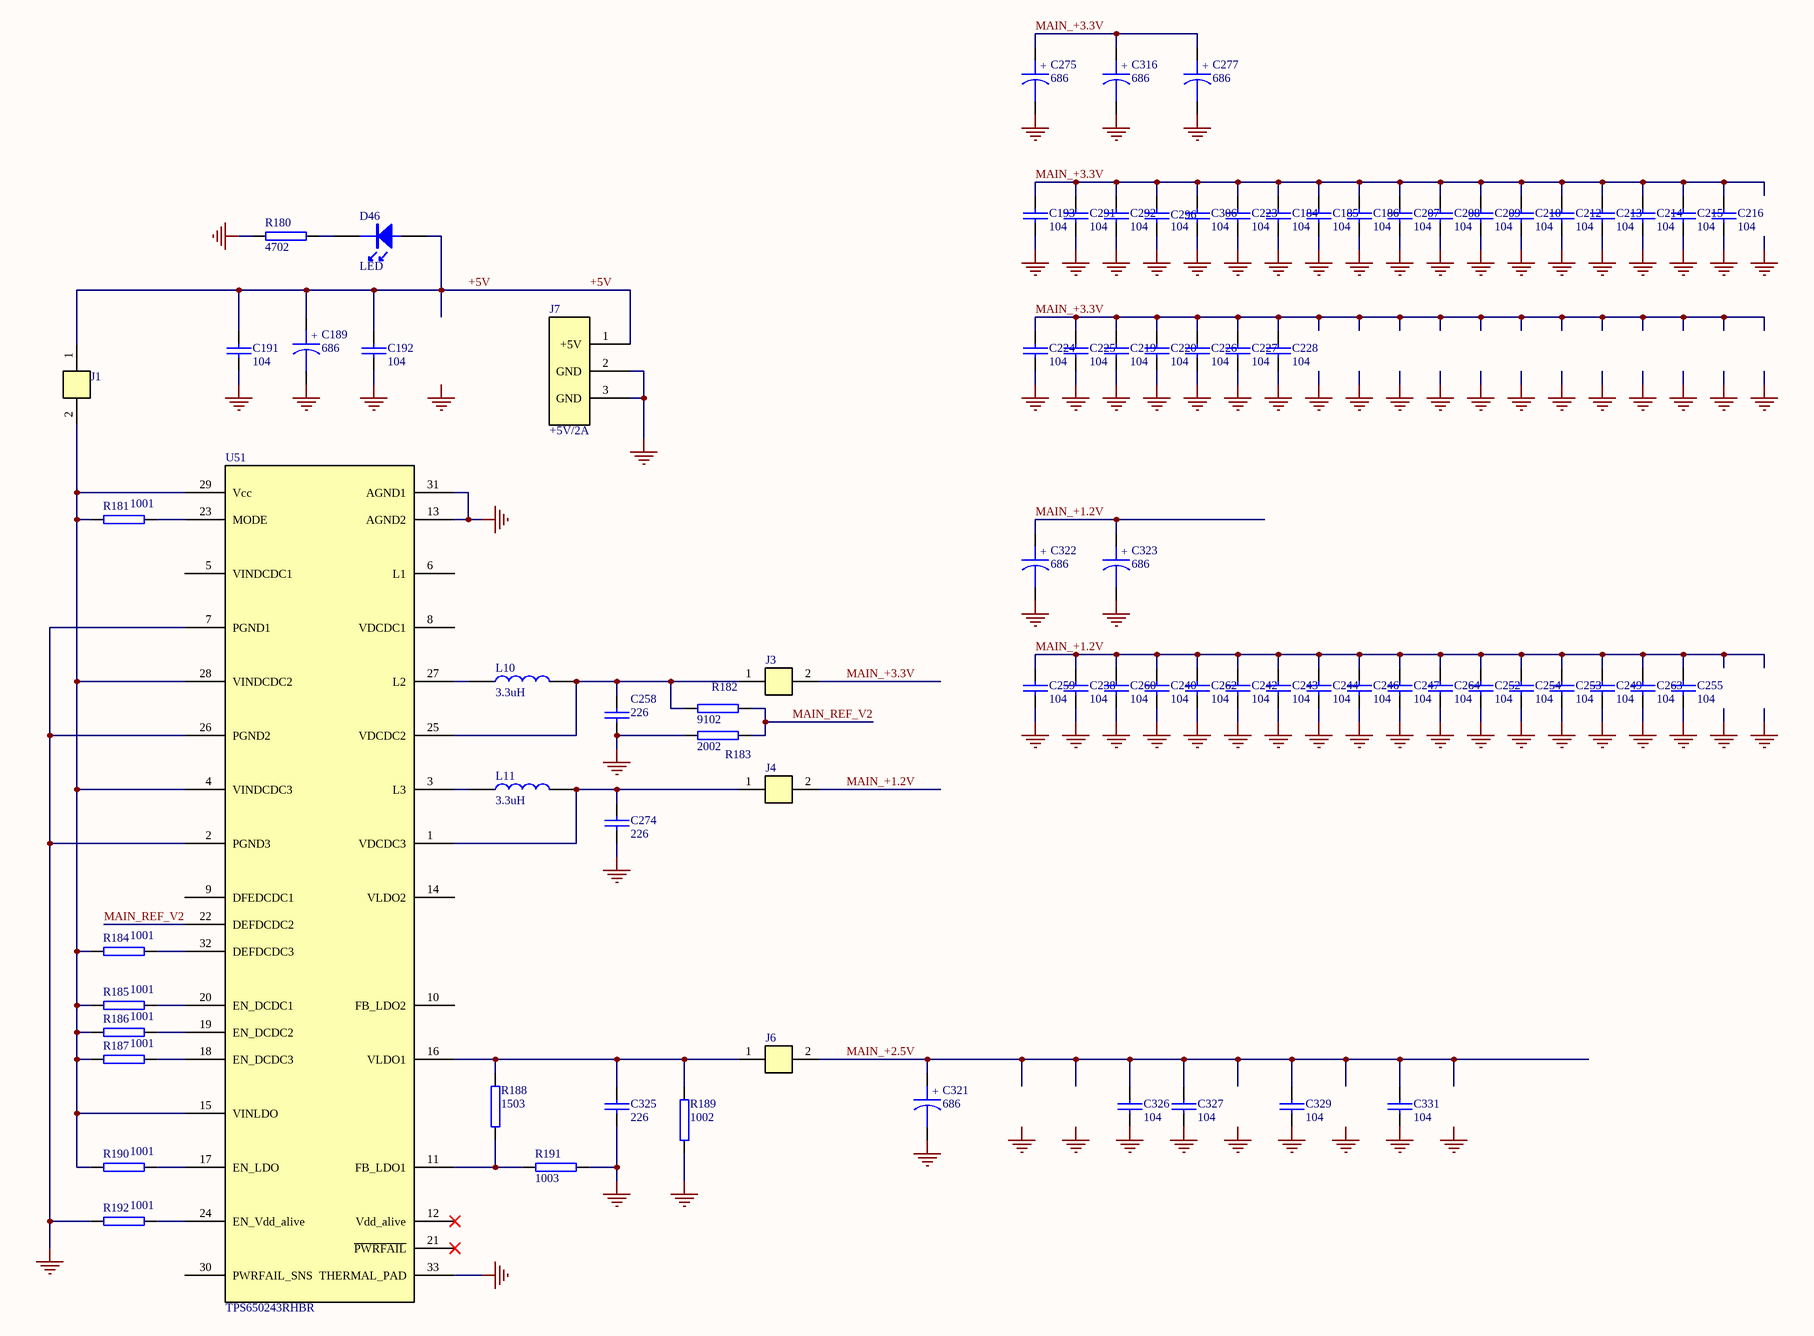
[diagram p8: FPGA_PWR.SchDoc]

### Parts
C184  104  [0402C]
C185  104  [0402C]
C186  104  [0402C]
C189  686  [6032]
C191  104  [0805C]
C192  104  [0805C]
C193  104  [0805-104]
C207  104  [0402C]
C208  104  [0402C]
C209  104  [0402C]
C210  104  [0402C]
C212  104  [0402C]
C213  104  [0402C]
C214  104  [0402C]
C215  104  [0402C]
C216  104  [0402C]
C219  104  [0402C]
C220  104  [0402C]
C223  104  [0402C]
C224  104  [0402C]
C225  104  [0402C]
C226  104  [0402C]
C227  104  [0402C]
C228  104  [0402C]
C238  104  [0402C]
C240  104  [0805-104]
C242  104  [0402C]
C243  104  [0402C]
C244  104  [0402C]
C246  104  [0402C]
C247  104  [0402C]
C249  104  [0402C]
C252  104  [0402C]
C253  104  [0402C]
C254  104  [0402C]
C255  104  [0805-104]
C258  226  [C226]
C259  104  [0402C]
C260  104  [0402C]
C262  104  [0402C]
C263  104  [0402C]
C264  104  [0402C]
C274  226  [C226]
C275  686  [6032]
C277  686  [6032]
C291  104  [0402C]
C292  104  [0402C]
C296  104  [0805C]
C306  104  [0402C]
C316  686  [6032]
C321  686  [6032]
C322  686  [6032]
C323  686  [6032]
C325  226  [C226]
C326  104  [0402C]
C327  104  [0402C]
C329  104  [0402C]
C331  104  [0402C]
D46  LED  [0805_LED]
J1  (no value)  [I_ON]
J3  (no value)  [I_ON]
J4  (no value)  [I_ON]
J6  (no value)  [I_ON]
J7  +5V/2A  [POW]
L10  3.3uH  [L3R3]
L11  3.3uH  [L3R3]
R180  4702  [0805R]
R181  1001  [0805R]
R182  9102  [0805]
R183  2002  [0805]
R184  1001  [0805]
R185  1001  [0805]
R186  1001  [0805]
R187  1001  [0805]
R188  1503  [0805]
R189  1002  [0805]
R190  1001  [0805]
R191  1003  [0805]
R192  1001  [0805]
U51  TPS650243RHBR  [VQFN32]

### Nets
DGND: C184.1 C185.1 C186.1 C189.2 C191.1 C192.1 C193.1 C207.1 C208.1 C209.1 C210.1 C212.1 C213.1 C214.1 C215.1 C216.1 C219.1 C220.1 C223.1 C224.1 C225.1 C226.1 C227.1 C228.1 C238.1 C240.1 C242.1 C243.1 C244.1 C246.1 C247.1 C249.1 C252.1 C253.1 C254.1 C255.1 C258.2 C259.1 C260.1 C262.1 C263.1 C264.1 C274.2 C275.2 C277.2 C291.1 C292.1 C296.1 C306.1 C316.2 C321.2 C322.2 C323.2 C325.2 C326.1 C327.1 C329.1 C331.1 J7.2(GND) J7.3(GND) R180.1 R183.2 R189.2 R191.2 R192.1 U51.2(PGND3) U51.7(PGND1) U51.13(AGND2) U51.26(PGND2) U51.31(AGND1) U51.33(THERMAL_PAD)
MAIN_+3.3V: C184.2 C185.2 C186.2 C193.2 C207.2 C208.2 C209.2 C210.2 C212.2 C213.2 C214.2 C215.2 C216.2 C219.2 C220.2 C223.2 C224.2 C225.2 C226.2 C227.2 C228.2 C275.1 C277.1 C291.2 C292.2 C296.2 C306.2 C316.1 J3.2  [project net CH_+3.3V]
+5V: C189.1 C191.2 C192.2 D46.1(A) J1.1 J7.1(+5V)
MAIN_+1.2V: C238.2 C240.2 C242.2 C243.2 C244.2 C246.2 C247.2 C249.2 C252.2 C253.2 C254.2 C255.2 C259.2 C260.2 C262.2 C263.2 C264.2 C322.1 C323.1 J4.2
MAIN_+2.5V: C321.1 C326.2 C327.2 C329.2 C331.2 J6.2
MAIN_REF_V2: R182.2 R183.1 U51.22(DEFDCDC2)
NetC258_1: C258.1 J3.1 L10.2 R182.1 U51.25(VDCDC2)
NetC274_1: C274.1 J4.1 L11.2 U51.1(VDCDC3)
NetC325_1: C325.1 J6.1 R188.2 R189.1 U51.16(VLDO1)
NetD46_2: D46.2(K) R180.2
NetJ1_2: J1.2 R181.1 R184.1 R185.1 R186.1 R187.1 R190.1 U51.4(VINDCDC3) U51.15(VINLDO) U51.28(VINDCDC2) U51.29(Vcc)
NetL10_1: L10.1 U51.27(L2)
NetL11_1: L11.1 U51.3(L3)
NetR181_2: R181.2 U51.23(MODE)
NetR184_2: R184.2 U51.32(DEFDCDC3)
NetR185_2: R185.2 U51.20(EN_DCDC1)
NetR186_2: R186.2 U51.19(EN_DCDC2)
NetR187_2: R187.2 U51.18(EN_DCDC3)
NetR188_1: R188.1 R191.1 U51.11(FB_LDO1)
NetR190_2: R190.2 U51.17(EN_LDO)
NetR192_2: R192.2 U51.24(EN_Vdd_alive)

Not connected (* = marked no-connect by the designer): U51 5(VINDCDC1) 6(L1) 8(VDCDC1) 9(DFEDCDC1) 10(FB_LDO2) 12(Vdd_alive)* 14(VLDO2) 21(~{PWRFAIL})* 30(PWRFAIL_SNS)

### Notes on the sheet
- Labels drawn without touching a wire or pin: DGND
- (in symbol CAPACITOR POL) +

### Library data of the parts
C184-C186 C191-C193 C207-C210 C212-C216 C219 C220 C223-C228 C238 C240 C242-C244 C246 C247 C249 C252-C255 C258-C260 C262-C264 C274 C291 C292 C296 C306 C325-C327 C329 C331 = CAP: Capacitor
C189 C275 C277 C316 C321-C323 = CAPACITOR POL: Capacitor
J1 J3 J4 J6 = I_ON
J7 = POW
L10 L11 = L
R180-R192 = RES2
U51 = TPS650243

## Sheet NET.SchDoc
size A3
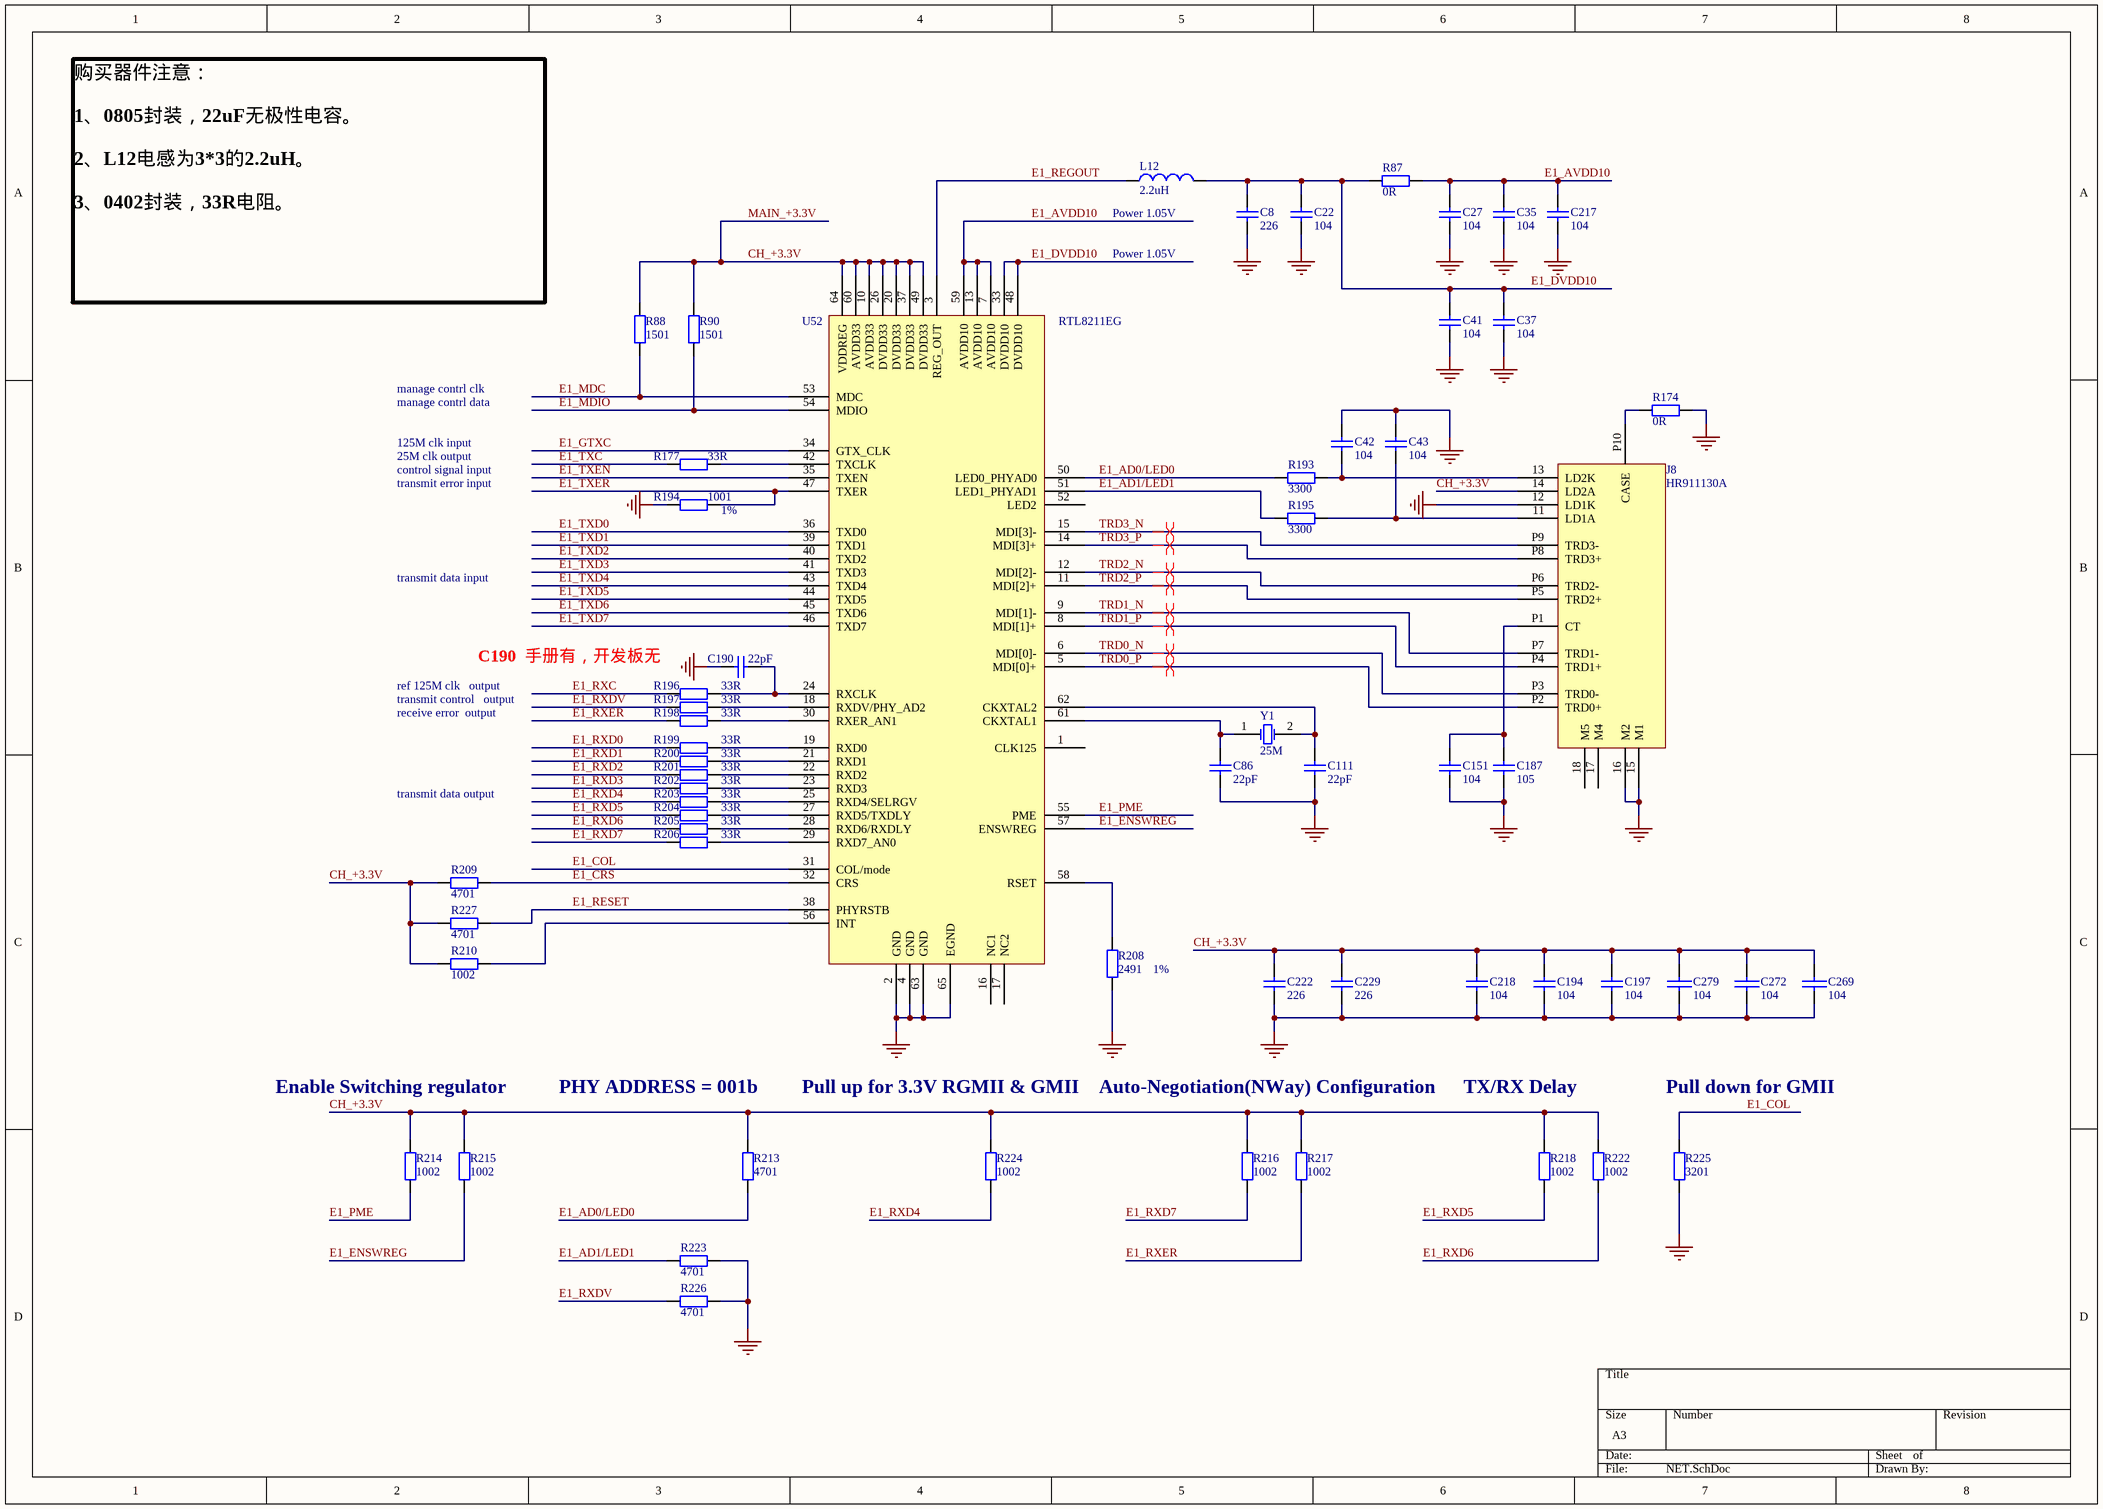
[diagram p9: NET.SchDoc]

### Parts
C8  226  [0805]
C22  104  [0402C]
C27  104  [0402C]
C35  104  [0402C]
C37  104  [0402C]
C41  104  [0402C]
C42  104  [0402C]
C43  104  [0402C]
C86  22pF  [0805]
C111  22pF  [0805]
C151  104  [0402C]
C187  105  [0805]
C190  22pF  [0402]
C194  104  [0402C]
C197  104  [0402C]
C217  104  [0402C]
C218  104  [0402C]
C222  226  [0805]
C229  226  [0805]
C269  104  [0402C]
C272  104  [0402C]
C279  104  [0402C]
J8  HR911130A  [GE_RJ45]
L12  2.2uH  [L22uH]
R87  0R  [R0603]
R88  1501  [R0603]
R90  1501  [R0603]
R174  0R  [R0603]
R177  33R  [0402]
R193  3300  [R0603]
R194  1001  [R0603]
R195  3300  [R0603]
R196  33R  [0402]
R197  33R  [0402]
R198  33R  [0402]
R199  33R  [0402]
R200  33R  [0402]
R201  33R  [0402]
R202  33R  [0402]
R203  33R  [0402]
R204  33R  [0402]
R205  33R  [0402]
R206  33R  [0402]
R208  2491  [R0603]
R209  4701  [R0603]
R210  1002  [R0603]
R213  4701  [R0603]
R214  1002  [R0603]
R215  1002  [R0603]
R216  1002  [R0603]
R217  1002  [R0603]
R218  1002  [R0603]
R222  1002  [R0603]
R223  4701  [R0603]
R224  1002  [R0603]
R225  3201  [R0603]
R226  4701  [R0603]
R227  4701  [R0603]
U52  RTL8211EG  [QFN65-050-0909]
Y1  25M  [XTAL]

### Nets
CH_+3.3V: C194.2 C197.2 C218.2 C222.1 C229.1 C269.2 C272.2 C279.2 J8.14(LD2A) R88.2 R90.2 R209.1 R210.2 R213.2 R214.1 R215.1 R216.1 R217.1 R218.1 R222.1 R224.1 R227.1 U52.10(AVDD33) U52.20(DVDD33) U52.26(DVDD33) U52.37(DVDD33) U52.49(DVDD33) U52.60(AVDD33) U52.64(VDDREG)  [also labelled MAIN_+3.3V]
DGND: C8.2 C22.1 C27.1 C35.1 C37.1 C41.1 C42.2 C43.2 C86.1 C111.1 C151.1 C187.1 C190.2 C194.1 C197.1 C217.1 C218.1 C222.2 C229.2 C269.1 C272.1 C279.1 J8.12(LD1K) J8.15(M1) J8.16(M2) R174.2 R194.2 R208.2 R223.2 R225.1 R226.2 U52.2(GND) U52.4(GND) U52.63(GND) U52.65(EGND)
E1_AD0/LED0: R193.2 R213.1 U52.50(LED0_PHYAD0)
E1_AD1/LED1: R195.2 R223.1 U52.51(LED1_PHYAD1)
E1_AVDD10: C27.2 C35.2 C217.2 R87.1 U52.7(AVDD10) U52.13(AVDD10) U52.59(AVDD10)
E1_COL: R225.2 U52.31(COL/mode)
E1_CRS: R209.2 U52.32(CRS)
E1_DVDD10: C8.1 C22.2 C37.2 C41.2 L12.2 R87.2 U52.33(DVDD10) U52.48(DVDD10)
E1_ENSWREG: R215.2 U52.57(ENSWREG)
E1_GTXC: U52.34(GTX_CLK)
E1_MDC: R88.1 U52.53(MDC)
E1_MDIO: R90.1 U52.54(MDIO)
E1_PME: R214.2 U52.55(PME)
E1_REGOUT: L12.1 U52.3(REG_OUT)
E1_RESET: R227.2 U52.38(PHYRSTB)
E1_RXC: R196.2
E1_RXD0: R199.2
E1_RXD1: R200.2
E1_RXD2: R201.2
E1_RXD3: R202.2
E1_RXD4: R203.2 R224.2
E1_RXD5: R204.1 R218.2
E1_RXD6: R205.2 R222.2
E1_RXD7: R206.2 R216.2
E1_RXDV: R197.2 R226.1
E1_RXER: R198.2 R217.2
E1_TXC: R177.2
E1_TXD0: U52.36(TXD0)
E1_TXD1: U52.39(TXD1)
E1_TXD2: U52.40(TXD2)
E1_TXD3: U52.41(TXD3)
E1_TXD4: U52.43(TXD4)
E1_TXD5: U52.44(TXD5)
E1_TXD6: U52.45(TXD6)
E1_TXD7: U52.46(TXD7)
E1_TXEN: U52.35(TXEN)
E1_TXER: R194.1 U52.47(TXER)
TRD0_N: J8.P3(TRD0-) U52.6(MDI[0]-)
TRD0_P: J8.P2(TRD0+) U52.5(MDI[0]+)
TRD1_N: J8.P7(TRD1-) U52.9(MDI[1]-)
TRD1_P: J8.P4(TRD1+) U52.8(MDI[1]+)
TRD2_N: J8.P6(TRD2-) U52.12(MDI[2]-)
TRD2_P: J8.P5(TRD2+) U52.11(MDI[2]+)
TRD3_N: J8.P9(TRD3-) U52.15(MDI[3]-)
TRD3_P: J8.P8(TRD3+) U52.14(MDI[3]+)
NetC42_1: C42.1 J8.13(LD2K) R193.1
NetC43_1: C43.1 J8.11(LD1A) R195.1
NetC86_2: C86.2 U52.61(CKXTAL1) Y1.1(OSC1)
NetC111_2: C111.2 U52.62(CKXTAL2) Y1.2(OSC2)
NetC151_2: C151.2 C187.2 J8.P1(CT)
NetC190_1: C190.1 R196.1 U52.24(RXCLK)
NetJ8_P10: J8.P10(CASE) R174.1
NetR177_1: R177.1 U52.42(TXCLK)
NetR197_1: R197.1 U52.18(RXDV/PHY_AD2)
NetR198_1: R198.1 U52.30(RXER_AN1)
NetR199_1: R199.1 U52.19(RXD0)
NetR200_1: R200.1 U52.21(RXD1)
NetR201_1: R201.1 U52.22(RXD2)
NetR202_1: R202.1 U52.23(RXD3)
NetR203_1: R203.1 U52.25(RXD4/SELRGV)
NetR204_2: R204.2 U52.27(RXD5/TXDLY)
NetR205_1: R205.1 U52.28(RXD6/RXDLY)
NetR206_1: R206.1 U52.29(RXD7_AN0)
NetR208_1: R208.1 U52.58(RSET)
NetR210_1: R210.1 U52.56(INT)

Not connected (* = marked no-connect by the designer): J8 17(M4) 18(M5); U52 1(CLK125) 16(NC1) 17(NC2) 52(LED2)

### Layout directives
differential pair: TRD0_N, TRD0_P, TRD1_N, TRD1_P, TRD2_N, TRD2_P, TRD3_N, TRD3_P

### Notes on the sheet
- (near L12) Power 1.05V
- 购买器件注意：
  1、0805封装，22uF无极性电容。
  2、L12电感为3*3的2.2uH。
  3、0402封装，33R电阻。
- Power 1.05V
- manage contrl clk
- manage contrl data
- 125M clk input
- 25M clk output
- control signal input
- transmit error input
- (near R194) 1%
- transmit data input
- ref 125M clk   output
- transmit control   output
- receive error  output
- C190  手册有，开发板无
- transmit data output
- (near R208) 1%
- Enable Switching regulator
- PHY ADDRESS = 001b
- Pull up for 3.3V RGMII & GMII
- Auto-Negotiation(NWay) Configuration
- TX/RX Delay
- Pull down for GMII

### Library data of the parts
C8 C22 C27 C35 C37 C41-C43 C86 C111 C151 C187 C190 C194 C197 C217 C218 C222 C229 = Cap: Capacitor; Published: 8-Jun-2000; LatestRevisionDate: 17-Jul-2002; LatestRevisionNote: Re-released for DXP Platform.; PackageReference: RAD-0.3; Publisher: Altium Limited
  C8 C222 C229: Value: 226
  C22 C27 C35 C37 C41-C43 C151 C194 C197 C217 C218: Value: 104
  C86 C111 C190: Value: 22pF
  C187: Value: 105
C269 C272 C279 = CAP: Capacitor
L12 = Inductor: Code_IEC: 1005; Published: 8-Jun-2000; LatestRevisionDate: 29-May-2009; LatestRevisionNote: IPC-7351 Footprint Added.; PackageReference: 0402-A; Publisher: Altium Limited; PackageDescription: Chip Inductor; Code_JEITA: 0402; Value: 2.2uH
R87 R88 R90 R174 R177 R193-R206 R208-R210 R213-R218 R222-R227 = Res2: Resistor; Published: 8-Jun-2000; LatestRevisionDate: 17-Jul-2002; LatestRevisionNote: Re-released for DXP Platform.; PackageReference: AXIAL-0.4; Publisher: Altium Limited
  R87 R174: Value: 0R
  R88 R90: Value: 1501
  R177 R196-R206: Value: 33R
  R193 R195: Value: 3300
  R194: Value: 1001
  R208: Value: 2491
  R209 R213 R223 R226 R227: Value: 4701
  R210 R214-R218 R222 R224: Value: 1002
  R225: Value: 3201
Y1 = XTAL: Crystal Oscillator; Published: 8-Jun-2000; LatestRevisionDate: 17-Jul-2002; LatestRevisionNote: Re-released for DXP Platform.; PackageReference: R38; Publisher: Altium Limited

## Sheet 485Driver_MAX3462.SchDoc
size A4
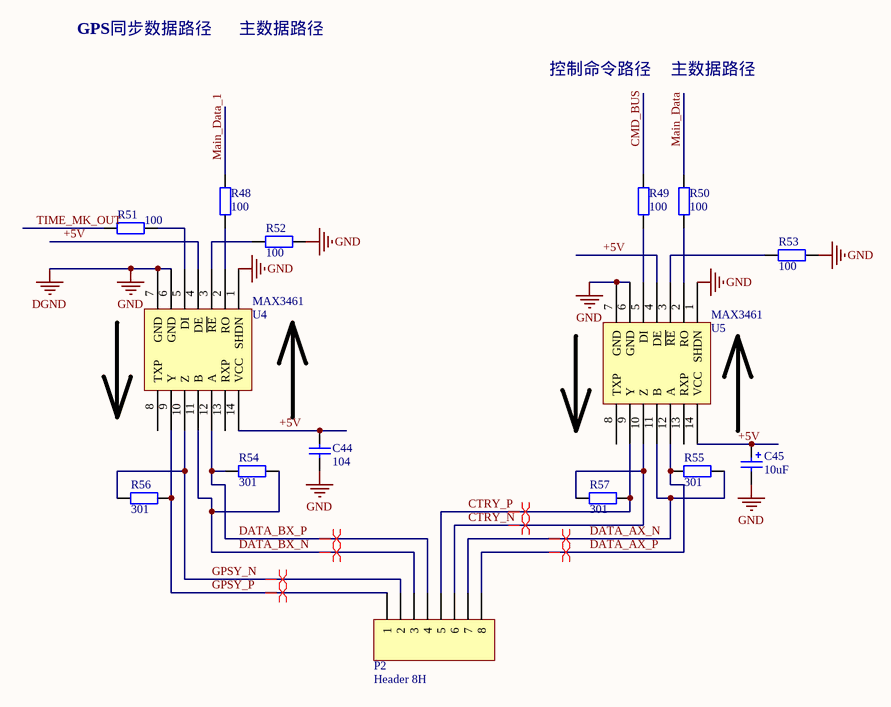
[diagram p10: 485Driver_MAX3462.SchDoc]

### Parts
C44  104  [0805C]
C45  10uF  [C68uF]
P2  Header 8H  [HDR1X8H]
R48  100  [0805R]
R49  100  [0805R]
R50  100  [0805R]
R51  100  [0805R]
R52  100  [0805R]
R53  100  [0805R]
R54  301  [0805R]
R55  301  [0805R]
R56  301  [0805R]
R57  301  [0805R]
U4  MAX3461  [SOP14]
U5  MAX3461  [SOP14]

### Nets
DGND: C44.1 C45.2 R52.2 R53.2 U4.1(SHDN) U4.6(GND) U4.7(GND) U5.1(SHDN) U5.6(GND) U5.7(GND)  [also labelled GND]
+5V: C44.2 C45.1 U4.4(DE) U4.14(VCC) U5.4(DE) U5.14(VCC)
CMD_BUS: R49.1
CTRY_N: P2.6 R57.2 U5.10(Z)
CTRY_P: P2.5 R57.1 U5.9(Y)
DATA_AX_N: P2.7 R55.1 U5.11(B)
DATA_AX_P: P2.8 R55.2 U5.12(A)
DATA_BX_N: P2.3 R54.1 U4.11(B)
DATA_BX_P: P2.4 R54.2 U4.12(A)
GPSY_N: P2.2 R56.2 U4.10(Z)
GPSY_P: P2.1 R56.1 U4.9(Y)
Main_Data: R50.1
Main_Data_1: R48.1
TIME_MK_OUT: R51.2
NetR48_2: R48.2 U4.2(RO)
NetR49_2: R49.2 U5.5(DI)
NetR50_2: R50.2 U5.2(RO)
NetR51_1: R51.1 U4.5(DI)
NetR52_1: R52.1 U4.3(~{RE})
NetR53_1: R53.1 U5.3(~{RE})

Not connected (* = marked no-connect by the designer): U4 8(TXP) 13(RXP); U5 8(TXP) 13(RXP)

### Layout directives
differential pair: CTRY_N, CTRY_P, DATA_AX_N, DATA_AX_P, DATA_BX_N, DATA_BX_P, GPSY_N, GPSY_P

### Notes on the sheet
- GPS同步数据路径
- 主数据路径
- 控制命令路径

### Library data of the parts
C44 = Cap: Capacitor; Value: 100nF; Published: 8-Jun-2000; LatestRevisionDate: 17-Jul-2002; LatestRevisionNote: Re-released for DXP Platform.; PackageReference: RAD-0.3; Publisher: Altium Limited
C45 = Cap Pol2: Polarized Capacitor (Axial); Value: 100pF; Published: 8-Jun-2000; LatestRevisionDate: 17-Jul-2002; LatestRevisionNote: Re-released for DXP Platform.; PackageReference: POLAR0.8; Publisher: Altium Limited
P2 = Header 8H: Header, 8-Pin, Right Angle; LatestRevisionDate: 17-Jul-2002; LatestRevisionNote: Re-released for DXP Platform.; Publisher: Altium Limited
R48-R57 = Res2: Resistor; Value: 1K; Published: 8-Jun-2000; LatestRevisionDate: 17-Jul-2002; LatestRevisionNote: Re-released for DXP Platform.; PackageReference: AXIAL-0.4; Publisher: Altium Limited